# EAGLE schematic MDCBoard (EAGLE 9.6.2)

## Sheet 1 of 12: VDD
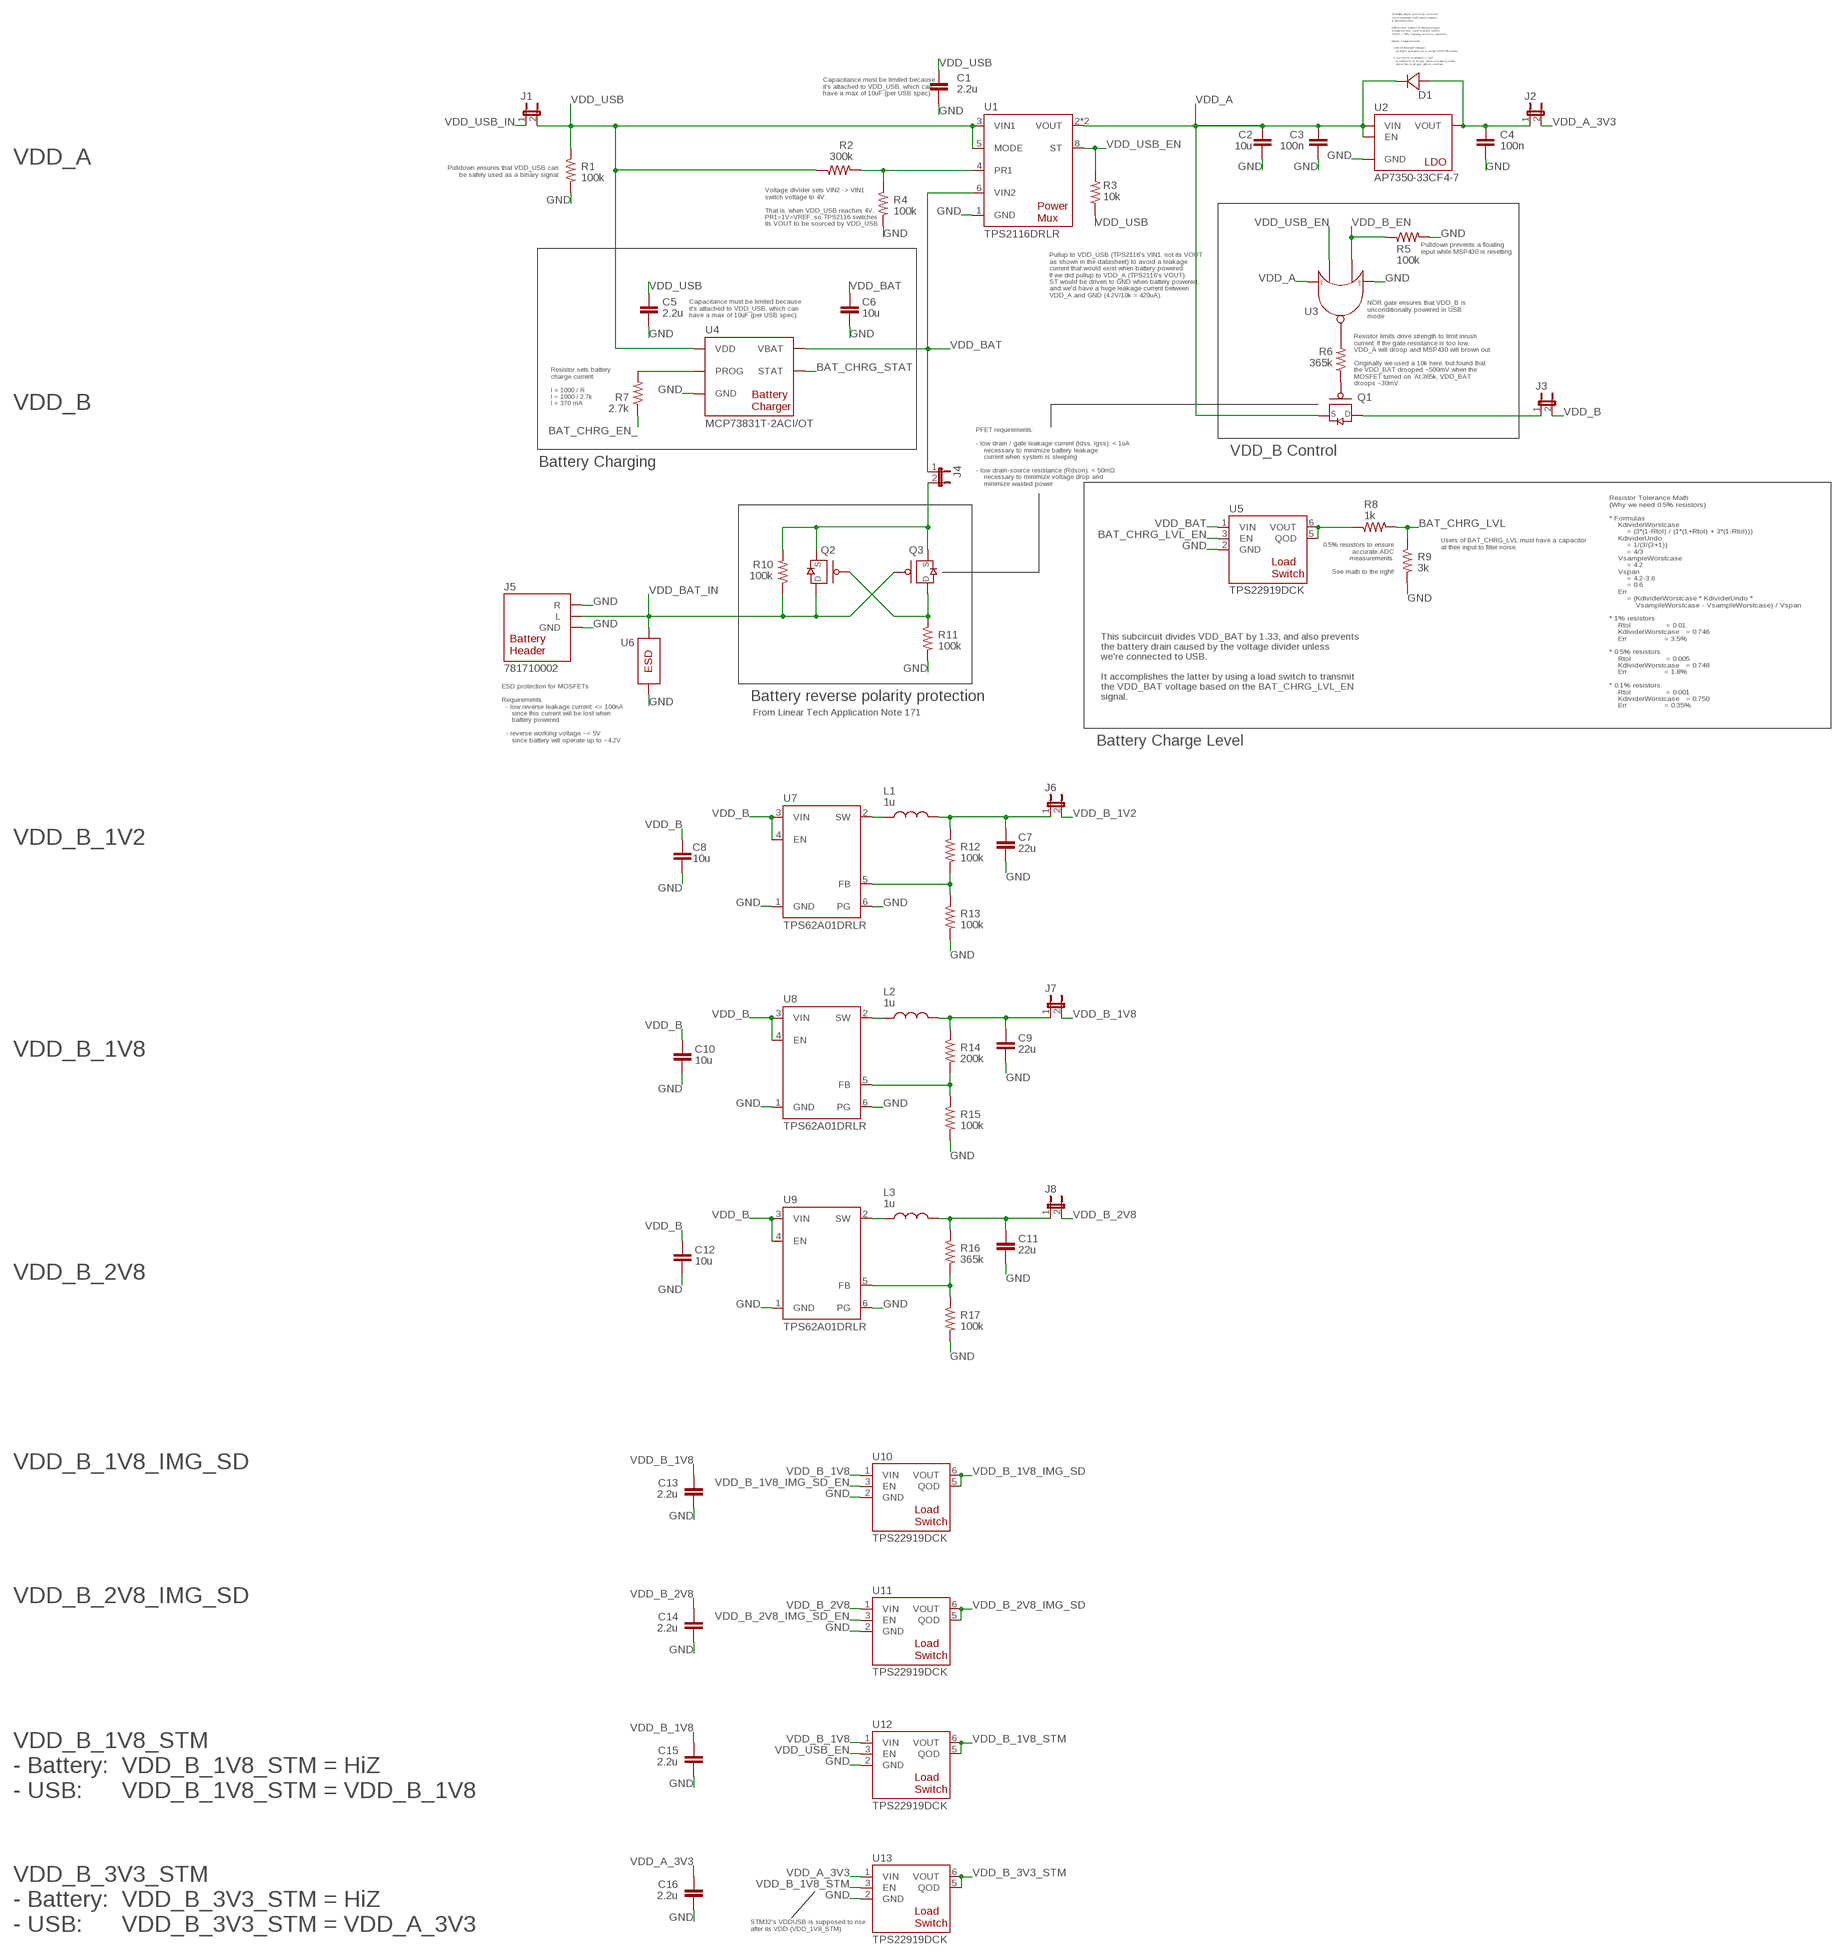
[diagram p0: schematic, sheet 1]

### Parts
C1  2.2u  CAPACITOR0402  [0402]
C2  10u  CAPACITOR0805  [0805]
C3  100n  CAPACITOR0402  [0402]
C4  100n  CAPACITOR0402  [0402]
C5  2.2u  CAPACITOR0402  [0402]
C6  10u  CAPACITOR0805  [0805]
C7  22u  CAPACITOR0805  [0805]
C8  10u  CAPACITOR0805  [0805]
C9  22u  CAPACITOR0805  [0805]
C10  10u  CAPACITOR0805  [0805]
C11  22u  CAPACITOR0805  [0805]
C12  10u  CAPACITOR0805  [0805]
C13  2.2u  CAPACITOR0402  [0402]
C14  2.2u  CAPACITOR0402  [0402]
C15  2.2u  CAPACITOR0402  [0402]
C16  2.2u  CAPACITOR0402  [0402]
D1  ROHM-RB168MM-40  [ROHM-SOD-123FL]
J1  JUMPER-SOLDER-CLOSED  [JUMPER-SOLDER-CLOSED]
J2  JUMPER-SOLDER-CLOSED  [JUMPER-SOLDER-CLOSED]
J3  JUMPER-SOLDER-CLOSED  [JUMPER-SOLDER-CLOSED]
J4  JUMPER-SOLDER-CLOSED  [JUMPER-SOLDER-CLOSED]
J5  BATTERY-HEADER-MOLEX-781710002  [MOLEX-781710002]
J6  JUMPER-SOLDER-CLOSED  [JUMPER-SOLDER-CLOSED]
J7  JUMPER-SOLDER-CLOSED  [JUMPER-SOLDER-CLOSED]
J8  JUMPER-SOLDER-CLOSED  [JUMPER-SOLDER-CLOSED]
L1  1u  INDUCTOR0806  [0806]
L2  1u  INDUCTOR0806  [0806]
L3  1u  INDUCTOR0806  [0806]
Q1  PMOS-NEXPERIA-SOT1220  [NEXPERIA-SOT1220]
Q2  PMOS-NEXPERIA-SOT1220  [NEXPERIA-SOT1220]
Q3  PMOS-NEXPERIA-SOT1220  [NEXPERIA-SOT1220]
R1  100k  RESISTOR0402  [0402]
R2  300k  RESISTOR0402  [0402]
R3  10k  RESISTOR0402  [0402]
R4  100k  RESISTOR0402  [0402]
R5  100k  RESISTOR0402  [0402]
R6  365k  RESISTOR0402  [0402]
R7  2.7k  RESISTOR0402  [0402]
R8  1k  RESISTOR0402  [0402]
R9  3k  RESISTOR0402  [0402]
R10  100k  RESISTOR0402  [0402]
R11  100k  RESISTOR0402  [0402]
R12  100k  RESISTOR0402  [0402]
R13  100k  RESISTOR0402  [0402]
R14  200k  RESISTOR0402  [0402]
R15  100k  RESISTOR0402  [0402]
R16  365k  RESISTOR0402  [0402]
R17  100k  RESISTOR0402  [0402]
U1  TI-TPS2116  [TI-TPS2116DRLR]
U2  DIODESINC-AP7350  [DIODESINC-AP7350]
U3  NEXPERIA-74LVC1G98-NOR  [NEXPERIA-SOT363]
U4  MICROCHIP-MCP7383X  [MICROCHIP-MIC550X-SOT23-5]
U5  TI-TPS22919DCK  [TI-TPS22919DCK]
U6  EATON-STN101  [EATON-STN101]
U7  TI-TPS62A01  [TI-TPS62A01DRLR]
U8  TI-TPS62A01  [TI-TPS62A01DRLR]
U9  TI-TPS62A01  [TI-TPS62A01DRLR]
U10  TI-TPS22919DCK  [TI-TPS22919DCK]
U11  TI-TPS22919DCK  [TI-TPS22919DCK]
U12  TI-TPS22919DCK  [TI-TPS22919DCK]
U13  TI-TPS22919DCK  [TI-TPS22919DCK]

### Nets
BAT_CHRG_EN_: R7.1 ; also sheet 10
BAT_CHRG_LVL: R8.2 R9.1 ; also sheet 2
BAT_CHRG_LVL_EN: U5.3(EN) ; also sheet 2
BAT_CHRG_STAT: U4.1(STAT) ; also sheet 10
GND: C1.2 C2.2 C3.2 C4.2 C5.2 C6.2 C7.2 C8.2 C9.2 C10.2 C11.2 C12.2 C13.2 C14.2 C15.2 C16.2 J5.2(R) J5.3(GND) J5.4(GND) R1.2 R4.2 R5.2 R9.2 R11.2 R13.2 R15.2 R17.2 U1.1(GND) U2.2(GND) U3.2(GND) U4.2(GND) U5.2(GND) U6.2 U7.1(GND) U7.6(PG) U8.1(GND) U8.6(PG) U9.1(GND) U9.6(PG) U10.2(GND) U11.2(GND) U12.2(GND) U13.2(GND) ; also sheet 2,3,4,5,6,7,8,9,10,11,12
N$1: J4.2 Q2.4(S) Q2.8(S) Q3.4(S) Q3.8(S) R10.2
N$3: C4.1 D1.A J2.1 U2.3(VOUT)
N$11: Q1.3(G) R6.1
N$12: R6.2 U3.4(OUT)
N$13: C11.1 J8.1 L3.2 R16.1
N$15: L2.1 U8.2(SW)
N$17: R8.1 U5.5(QOD) U5.6(VOUT)
N$18: R14.2 R15.1 U8.5(FB)
N$19: C9.1 J7.1 L2.2 R14.1
N$21: R7.2 U4.5(PROG)
N$22: L3.1 U9.2(SW)
N$24: L1.1 U7.2(SW)
N$32: Q2.3(G) Q3.1(D) Q3.2(D) Q3.5(D) Q3.6(D) Q3.7(D) R11.1
N$33: R16.2 R17.1 U9.5(FB)
N$34: R12.2 R13.1 U7.5(FB)
N$38: C7.1 J6.1 L1.2 R12.1
N$42: R2.2 R4.1 U1.4(PR1)
N$43: J3.1 Q1.1(D) Q1.2(D) Q1.5(D) Q1.6(D) Q1.7(D)
VDD_A: C2.1 C3.1 D1.C Q1.4(S) Q1.8(S) U1.2(VOUT) U1.7(VOUT) U2.1(EN) U2.4(VIN) U3.3(VDD) U3.5(VDD)
VDD_A_3V3: C16.1 J2.2 U13.1(VIN) ; also sheet 2,3,5
VDD_B: C8.1 C10.1 C12.1 J3.2 U7.3(VIN) U7.4(EN) U8.3(VIN) U8.4(EN) U9.3(VIN) U9.4(EN)
VDD_B_1V2: J6.2 ; also sheet 6
VDD_B_1V8: C13.1 C15.1 J7.2 U10.1(VIN) U12.1(VIN) ; also sheet 2,6,8
VDD_B_1V8_IMG_SD: U10.5(QOD) U10.6(VOUT) ; also sheet 7,9
VDD_B_1V8_IMG_SD_EN: U10.3(EN) ; also sheet 2
VDD_B_1V8_STM: U12.5(QOD) U12.6(VOUT) U13.3(EN) ; also sheet 10
VDD_B_2V8: C14.1 J8.2 U11.1(VIN) ; also sheet 6
VDD_B_2V8_IMG_SD: U11.5(QOD) U11.6(VOUT) ; also sheet 7,9
VDD_B_2V8_IMG_SD_EN: U11.3(EN) ; also sheet 2
VDD_B_3V3_STM: U13.5(QOD) U13.6(VOUT) ; also sheet 2,10
VDD_B_EN: R5.1 U3.6(IN2) ; also sheet 2
VDD_BAT: C6.1 J4.1 U1.6(VIN2) U4.3(VBAT) U5.1(VIN)
VDD_BAT_IN: J5.1(L) Q2.1(D) Q2.2(D) Q2.5(D) Q2.6(D) Q2.7(D) Q3.3(G) R10.1 U6.1
VDD_USB: C1.1 C5.1 J1.2 R1.1 R2.1 R3.1 U1.3(VIN1) U1.5(MODE) U4.4(VDD)
VDD_USB_EN: R3.2 U1.8(ST) U3.1(IN1) U12.3(EN)
VDD_USB_IN: J1.1 ; also sheet 10,11

### Notes on the sheet
- Schottky diode prevents reverse
  current through LDO when battery
  is disconnected.
  
  (When the battery is disconnected,
  it could be the case that the LDO's
  VOUT > VIN, causing reverse current.)
  
  Diode requirements:
  
  - Low Vf (forward voltage)
      so that it activates on a small VOUT-VIN delta
  
  - Ir (reverse leakage) < 1µA
      to minimize leakage when in battery-mode,
      since this leakage will be constant
- Capacitance must be limited because
  it's attached to VDD_USB, which can
  have a max of 10uF (per USB spec).
- VDD_A
- Pulldown ensures that VDD_USB can
  be safely used as a binary signal
- Voltage divider sets VIN2 -> VIN1
  switch voltage to 4V.
  
  That is, when VDD_USB reaches 4V,
  PR1=1V=VREF, so TPS2116 switches
  its VOUT to be sourced by VDD_USB.
- Pulldown prevents a floating
  input while MSP430 is resetting
- Pullup to VDD_USB (TPS2116's VIN1, not its VOUT
  as shown in the datasheet) to avoid a leakage
  current that would exist when battery powered.
  If we did pullup to VDD_A (TPS2116's VOUT),
  ST would be driven to GND when battery powered,
  and we'd have a huge leakage current between
  VDD_A and GND (4.2V/10k = 420uA).
- Capacitance must be limited because
  it's attached to VDD_USB, which can
  have a max of 10uF (per USB spec).
- NOR gate ensures that VDD_B is
  unconditionally powered in USB
  mode
- Resistor limits drive strength to limit inrush
  current. If the gate resistance is too low,
  VDD_A will droop and MSP430 will brown out.
  
  Originally we used a 10k here, but found that
  the VDD_BAT drooped ~500mV when the
  MOSFET turned on. At 365k, VDD_BAT
  droops ~30mV.
- Resistor sets battery
  charge current:
  
  I = 1000 / R
  I = 1000 / 2.7k
  I = 370 mA
- VDD_B
- PFET requirements:
  
  - low drain / gate leakage current (Idss, Igss): < 1uA
      necessary to minimize battery leakage
      current when system is sleeping
  
  - low drain-source resistance (Rdson): < 50mΩ
      necessary to minimize voltage drop and
      minimize wasted power
- VDD_B Control
- Battery Charging
- Resistor Tolerance Math
  (Why we need 0.5% resistors)
  
  * Formulas
      KdividerWorstcase
          = (3*(1-Rtol) / (1*(1+Rtol) + 3*(1-Rtol)))
      KdividerUndo
          = 1/(3/(3+1))
          = 4/3
      VsampleWorstcase
          = 4.2
      Vspan
          = 4.2-3.6
          = 0.6
      Err
          = (KdividerWorstcase * KdividerUndo *
              VsampleWorstcase - VsampleWorstcase) / Vspan
  
  * 1% resistors:
      Rtol                = 0.01
      KdividerWorstcase   = 0.746
      Err                 = 3.5%
  
  * 0.5% resistors:
      Rtol                = 0.005
      KdividerWorstcase   = 0.748
      Err                 = 1.8%
  
  * 0.1% resistors:
      Rtol                = 0.001
      KdividerWorstcase   = 0.750
      Err                 = 0.35%
- Users of BAT_CHRG_LVL must have a capacitor
  at their input to filter noise.
- 0.5% resistors to ensure
  accurate ADC
  measurements.
  
  See math to the right!
- This subcircuit divides VDD_BAT by 1.33, and also prevents
  the battery drain caused by the voltage divider unless
  we're connected to USB.
  
  It accomplishes the latter by using a load switch to transmit
  the VDD_BAT voltage based on the BAT_CHRG_LVL_EN
  signal.
- ESD protection for MOSFETs
  
  Requirements:
    - low reverse leakage current: <= 100nA
       since this current will be lost when
       battery powered
  
    - reverse working voltage ~= 5V
       since battery will operate up to ~4.2V
- Battery reverse polarity protection
- From Linear Tech Application Note 171
- Battery Charge Level
- VDD_B_1V2
- VDD_B_1V8
- VDD_B_2V8
- VDD_B_1V8_IMG_SD
- VDD_B_2V8_IMG_SD
- VDD_B_1V8_STM
  - Battery:  VDD_B_1V8_STM = HiZ
  - USB:      VDD_B_1V8_STM = VDD_B_1V8
- VDD_B_3V3_STM
  - Battery:  VDD_B_3V3_STM = HiZ
  - USB:      VDD_B_3V3_STM = VDD_A_3V3
- STM32's VDDUSB is supposed to rise
  after its VDD (VDD_1V8_STM)

## Sheet 2 of 12: MSP
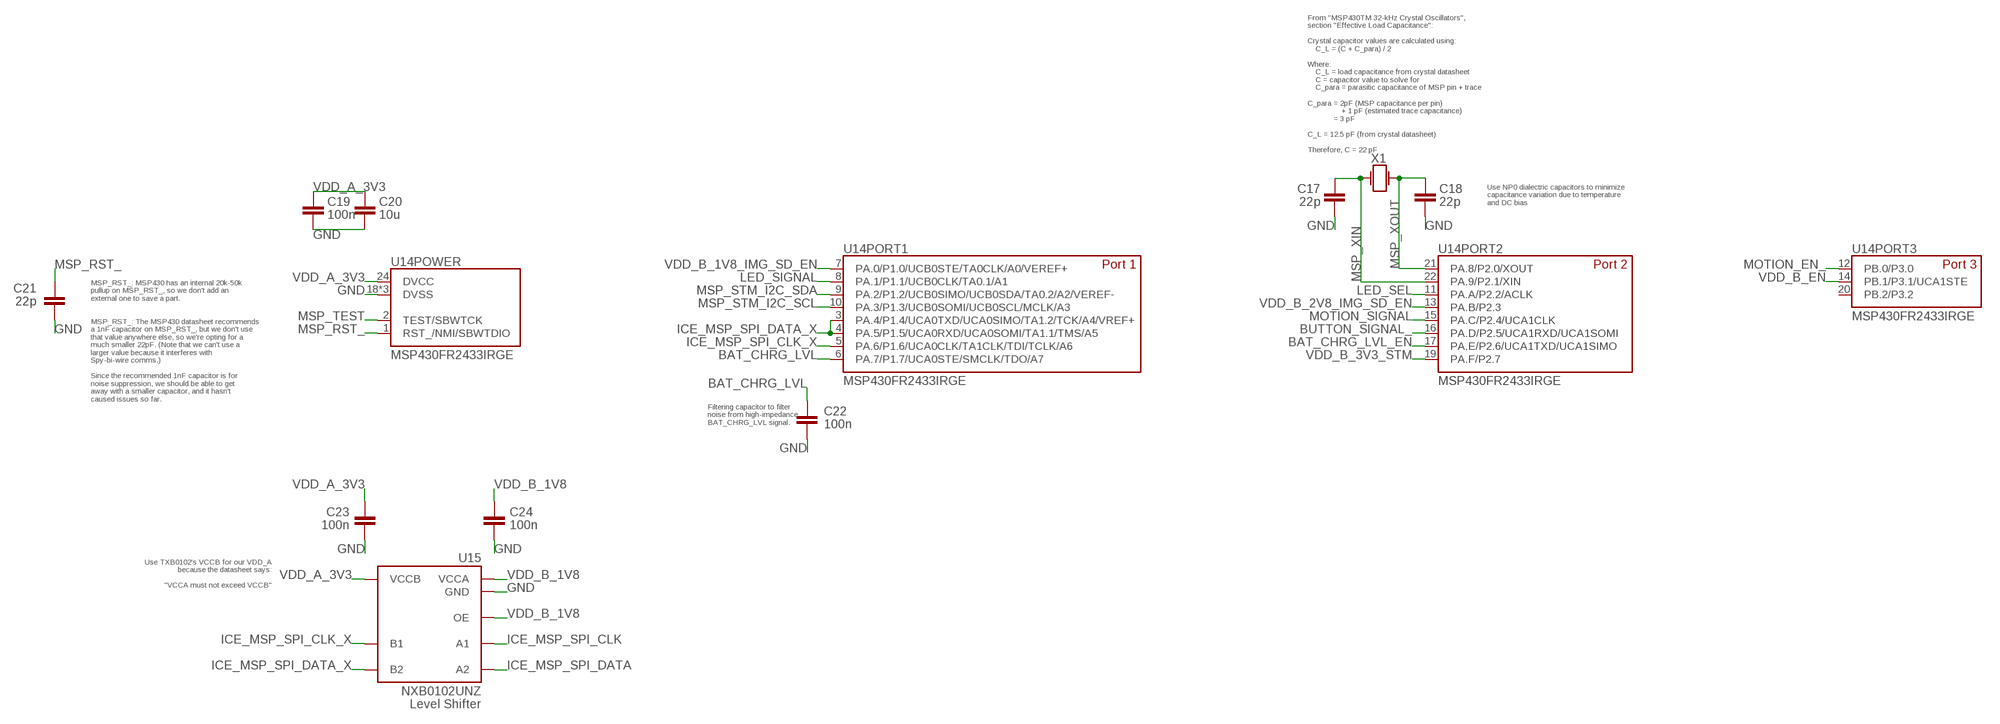
[diagram p1: schematic, sheet 2]

### Parts
C17  22p  CAPACITOR0402  [0402]
C18  22p  CAPACITOR0402  [0402]
C19  100n  CAPACITOR0402  [0402]
C20  10u  CAPACITOR0805  [0805]
C21  22p  CAPACITOR0402  [0402]
C22  100n  CAPACITOR0402  [0402]
C23  100n  CAPACITOR0402  [0402]
C24  100n  CAPACITOR0402  [0402]
U14  TI-MSP430FR2433IRGE  [TI-MSP430FR2433IRGE]
U15  NEXPERIA-NXB0102  [NEXPERIA-NXB0102UN]
X1  EPSON-FC-135  [EPSON-FC-135]

### Nets
BAT_CHRG_LVL: C22.1 U14.6(PORT1:PA.7/P1.7/UCA0STE/SMCLK/TDO/A7) ; also sheet 1
BAT_CHRG_LVL_EN: U14.17(PORT2:PA.E/P2.6/UCA1TXD/UCA1SIMO) ; also sheet 1
BUTTON_SIGNAL_: U14.16(PORT2:PA.D/P2.5/UCA1RXD/UCA1SOMI) ; also sheet 4
GND: C17.2 C18.2 C19.2 C20.2 C21.2 C22.2 C23.2 C24.2 U14.18(POWER:DVSS) U14.23(POWER:DVSS) U14.25(POWER:DVSS) U15.B1(GND) ; also sheet 1,3,4,5,6,7,8,9,10,11,12
ICE_MSP_SPI_CLK: U15.D2(A1) ; also sheet 6
ICE_MSP_SPI_CLK_X: U14.5(PORT1:PA.6/P1.6/UCA0CLK/TA1CLK/TDI/TCLK/A6) U15.A2(B1)
ICE_MSP_SPI_DATA: U15.D1(A2) ; also sheet 6
ICE_MSP_SPI_DATA_X: U14.3(PORT1:PA.4/P1.4/UCA0TXD/UCA0SIMO/TA1.2/TCK/A4/VREF+) U14.4(PORT1:PA.5/P1.5/UCA0RXD/UCA0SOMI/TA1.1/TMS/A5) U15.A1(B2)
LED_SEL: U14.11(PORT2:PA.A/P2.2/ACLK) ; also sheet 3
LED_SIGNAL: U14.8(PORT1:PA.1/P1.1/UCB0CLK/TA0.1/A1) ; also sheet 3
MOTION_EN_: U14.12(PORT3:PB.0/P3.0) ; also sheet 5
MOTION_SIGNAL: U14.15(PORT2:PA.C/P2.4/UCA1CLK) ; also sheet 5
MSP_RST_: C21.1 U14.1(POWER:RST_/NMI/SBWTDIO) ; also sheet 10
MSP_STM_I2C_SCL: U14.10(PORT1:PA.3/P1.3/UCB0SOMI/UCB0SCL/MCLK/A3) ; also sheet 10
MSP_STM_I2C_SDA: U14.9(PORT1:PA.2/P1.2/UCB0SIMO/UCB0SDA/TA0.2/A2/VEREF-) ; also sheet 10
MSP_TEST: U14.2(POWER:TEST/SBWTCK) ; also sheet 10
MSP_XIN: C17.1 U14.22(PORT2:PA.9/P2.1/XIN) X1.2(B)
MSP_XOUT: C18.1 U14.21(PORT2:PA.8/P2.0/XOUT) X1.1(A)
VDD_A_3V3: C19.1 C20.1 C23.1 U14.24(POWER:DVCC) U15.B2(VCCB) ; also sheet 1,3,5
VDD_B_1V8: C24.1 U15.C1(VCCA) U15.C2(OE) ; also sheet 1,6,8
VDD_B_1V8_IMG_SD_EN: U14.7(PORT1:PA.0/P1.0/UCB0STE/TA0CLK/A0/VEREF+) ; also sheet 1
VDD_B_2V8_IMG_SD_EN: U14.13(PORT2:PA.B/P2.3) ; also sheet 1
VDD_B_3V3_STM: U14.19(PORT2:PA.F/P2.7) ; also sheet 1,10
VDD_B_EN: U14.14(PORT3:PB.1/P3.1/UCA1STE) ; also sheet 1
Unconnected: U14.20(PORT3:PB.2/P3.2)

### Notes on the sheet
- From "MSP430TM 32-kHz Crystal Oscillators",
  section "Effective Load Capacitance":
  
  Crystal capacitor values are calculated using:
      C_L = (C + C_para) / 2
  
  Where:
      C_L = load capacitance from crystal datasheet
      C = capacitor value to solve for
      C_para = parasitic capacitance of MSP pin + trace
  
  C_para = 2pF (MSP capacitance per pin)
                   + 1 pF (estimated trace capacitance)
               = 3 pF
  
  C_L = 12.5 pF (from crystal datasheet)
  
  Therefore, C = 22 pF
- Use NP0 dialectric capacitors to minimize
  capacitance variation due to temperature
  and DC bias
- MSP_RST_: MSP430 has an internal 20k-50k
  pullup on MSP_RST_, so we don't add an
  external one to save a part.
- MSP_RST_: The MSP430 datasheet recommends
  a 1nF capacitor on MSP_RST_, but we don't use
  that value anywhere else, so we're opting for a
  much smaller 22pF. (Note that we can't use a
  larger value because it interferes with
  Spy-bi-wire comms.)
  
  Since the recommended 1nF capacitor is for
  noise suppression, we should be able to get
  away with a smaller capacitor, and it hasn't
  caused issues so far.
- Filtering capacitor to filter
  noise from high-impedance
  BAT_CHRG_LVL signal.
- Use TXB0102's VCCB for our VDD_A
  because the datasheet says:
  
  "VCCA must not exceed VCCB"

## Sheet 3 of 12: LED
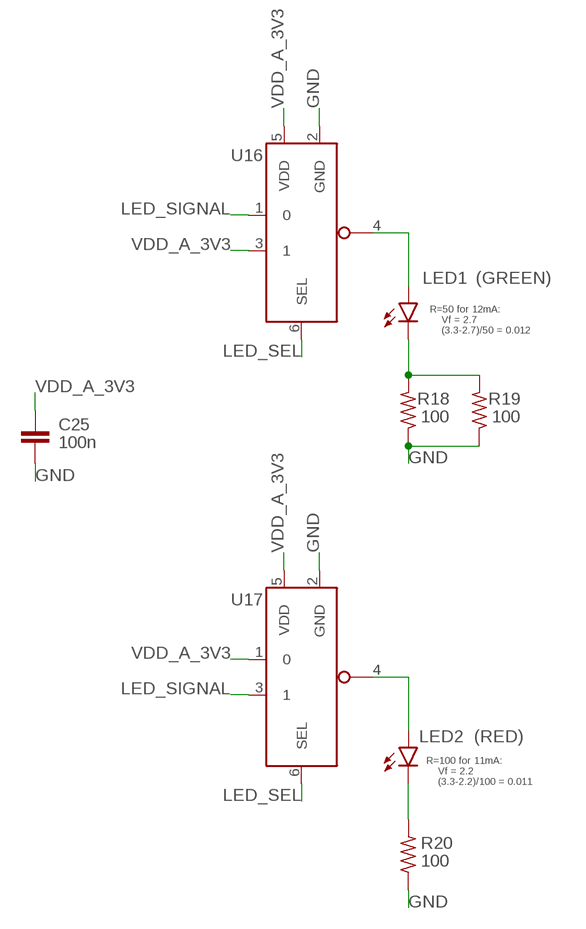
[diagram p2: schematic, sheet 3]

### Parts
C25  100n  CAPACITOR0402  [0402]
LED1  LEDOSRAM-TOPLED-E1608  [OSRAM-TOPLED-E1608]
LED2  LEDOSRAM-TOPLED-E1608  [OSRAM-TOPLED-E1608]
R18  100  RESISTOR0402  [0402]
R19  100  RESISTOR0402  [0402]
R20  100  RESISTOR0402  [0402]
U16  NEXPERIA-74LVC1G98-MUX-INV-OUTPUT  [NEXPERIA-SOT363]
U17  NEXPERIA-74LVC1G98-MUX-INV-OUTPUT  [NEXPERIA-SOT363]

### Nets
GND: C25.2 R18.1 R19.1 R20.1 U16.2(GND) U17.2(GND) ; also sheet 1,2,4,5,6,7,8,9,10,11,12
LED_SEL: U16.6(SEL) U17.6(SEL) ; also sheet 2
LED_SIGNAL: U16.1 U17.3 ; also sheet 2
N$5: LED1.A U16.4(OUT)
N$6: LED2.A U17.4(OUT)
N$16: LED2.C R20.2
N$45: LED1.C R18.2 R19.2
VDD_A_3V3: C25.1 U16.3 U16.5(VDD) U17.1 U17.5(VDD) ; also sheet 1,2,5

### Notes on the sheet
- (GREEN)
- R=50 for 12mA:
      Vf = 2.7
      (3.3-2.7)/50 = 0.012
- (RED)
- R=100 for 11mA:
      Vf = 2.2
      (3.3-2.2)/100 = 0.011

## Sheet 4 of 12: BUTTON
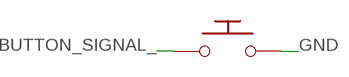
[diagram p3: schematic, sheet 4]

### Parts
SW1  TACTILE-SWITCH  [DEALON-TD-1624UR-180]

### Nets
BUTTON_SIGNAL_: SW1.1 ; also sheet 2
GND: SW1.2 ; also sheet 1,2,3,5,6,7,8,9,10,11,12

## Sheet 5 of 12: MOTION
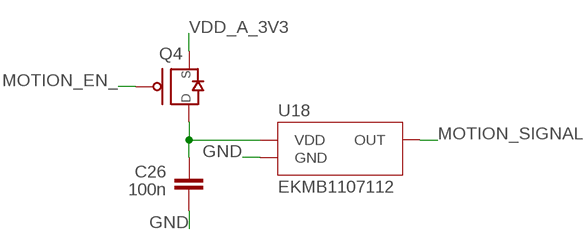
[diagram p4: schematic, sheet 5]

### Parts
C26  100n  CAPACITOR0402  [0402]
Q4  DIODESINC-DMG2305UX  [DIODESINC-DMG2305UX]
U18  PANASONIC-EKMB110711X  [PANASONIC-EKMB110711X]

### Nets
GND: C26.2 U18.3(GND) ; also sheet 1,2,3,4,6,7,8,9,10,11,12
MOTION_EN_: Q4.G ; also sheet 2
MOTION_SIGNAL: U18.2(OUT) ; also sheet 2
N$8: C26.1 Q4.D U18.1(VDD)
VDD_A_3V3: Q4.S ; also sheet 1,2,3

## Sheet 6 of 12: ICE
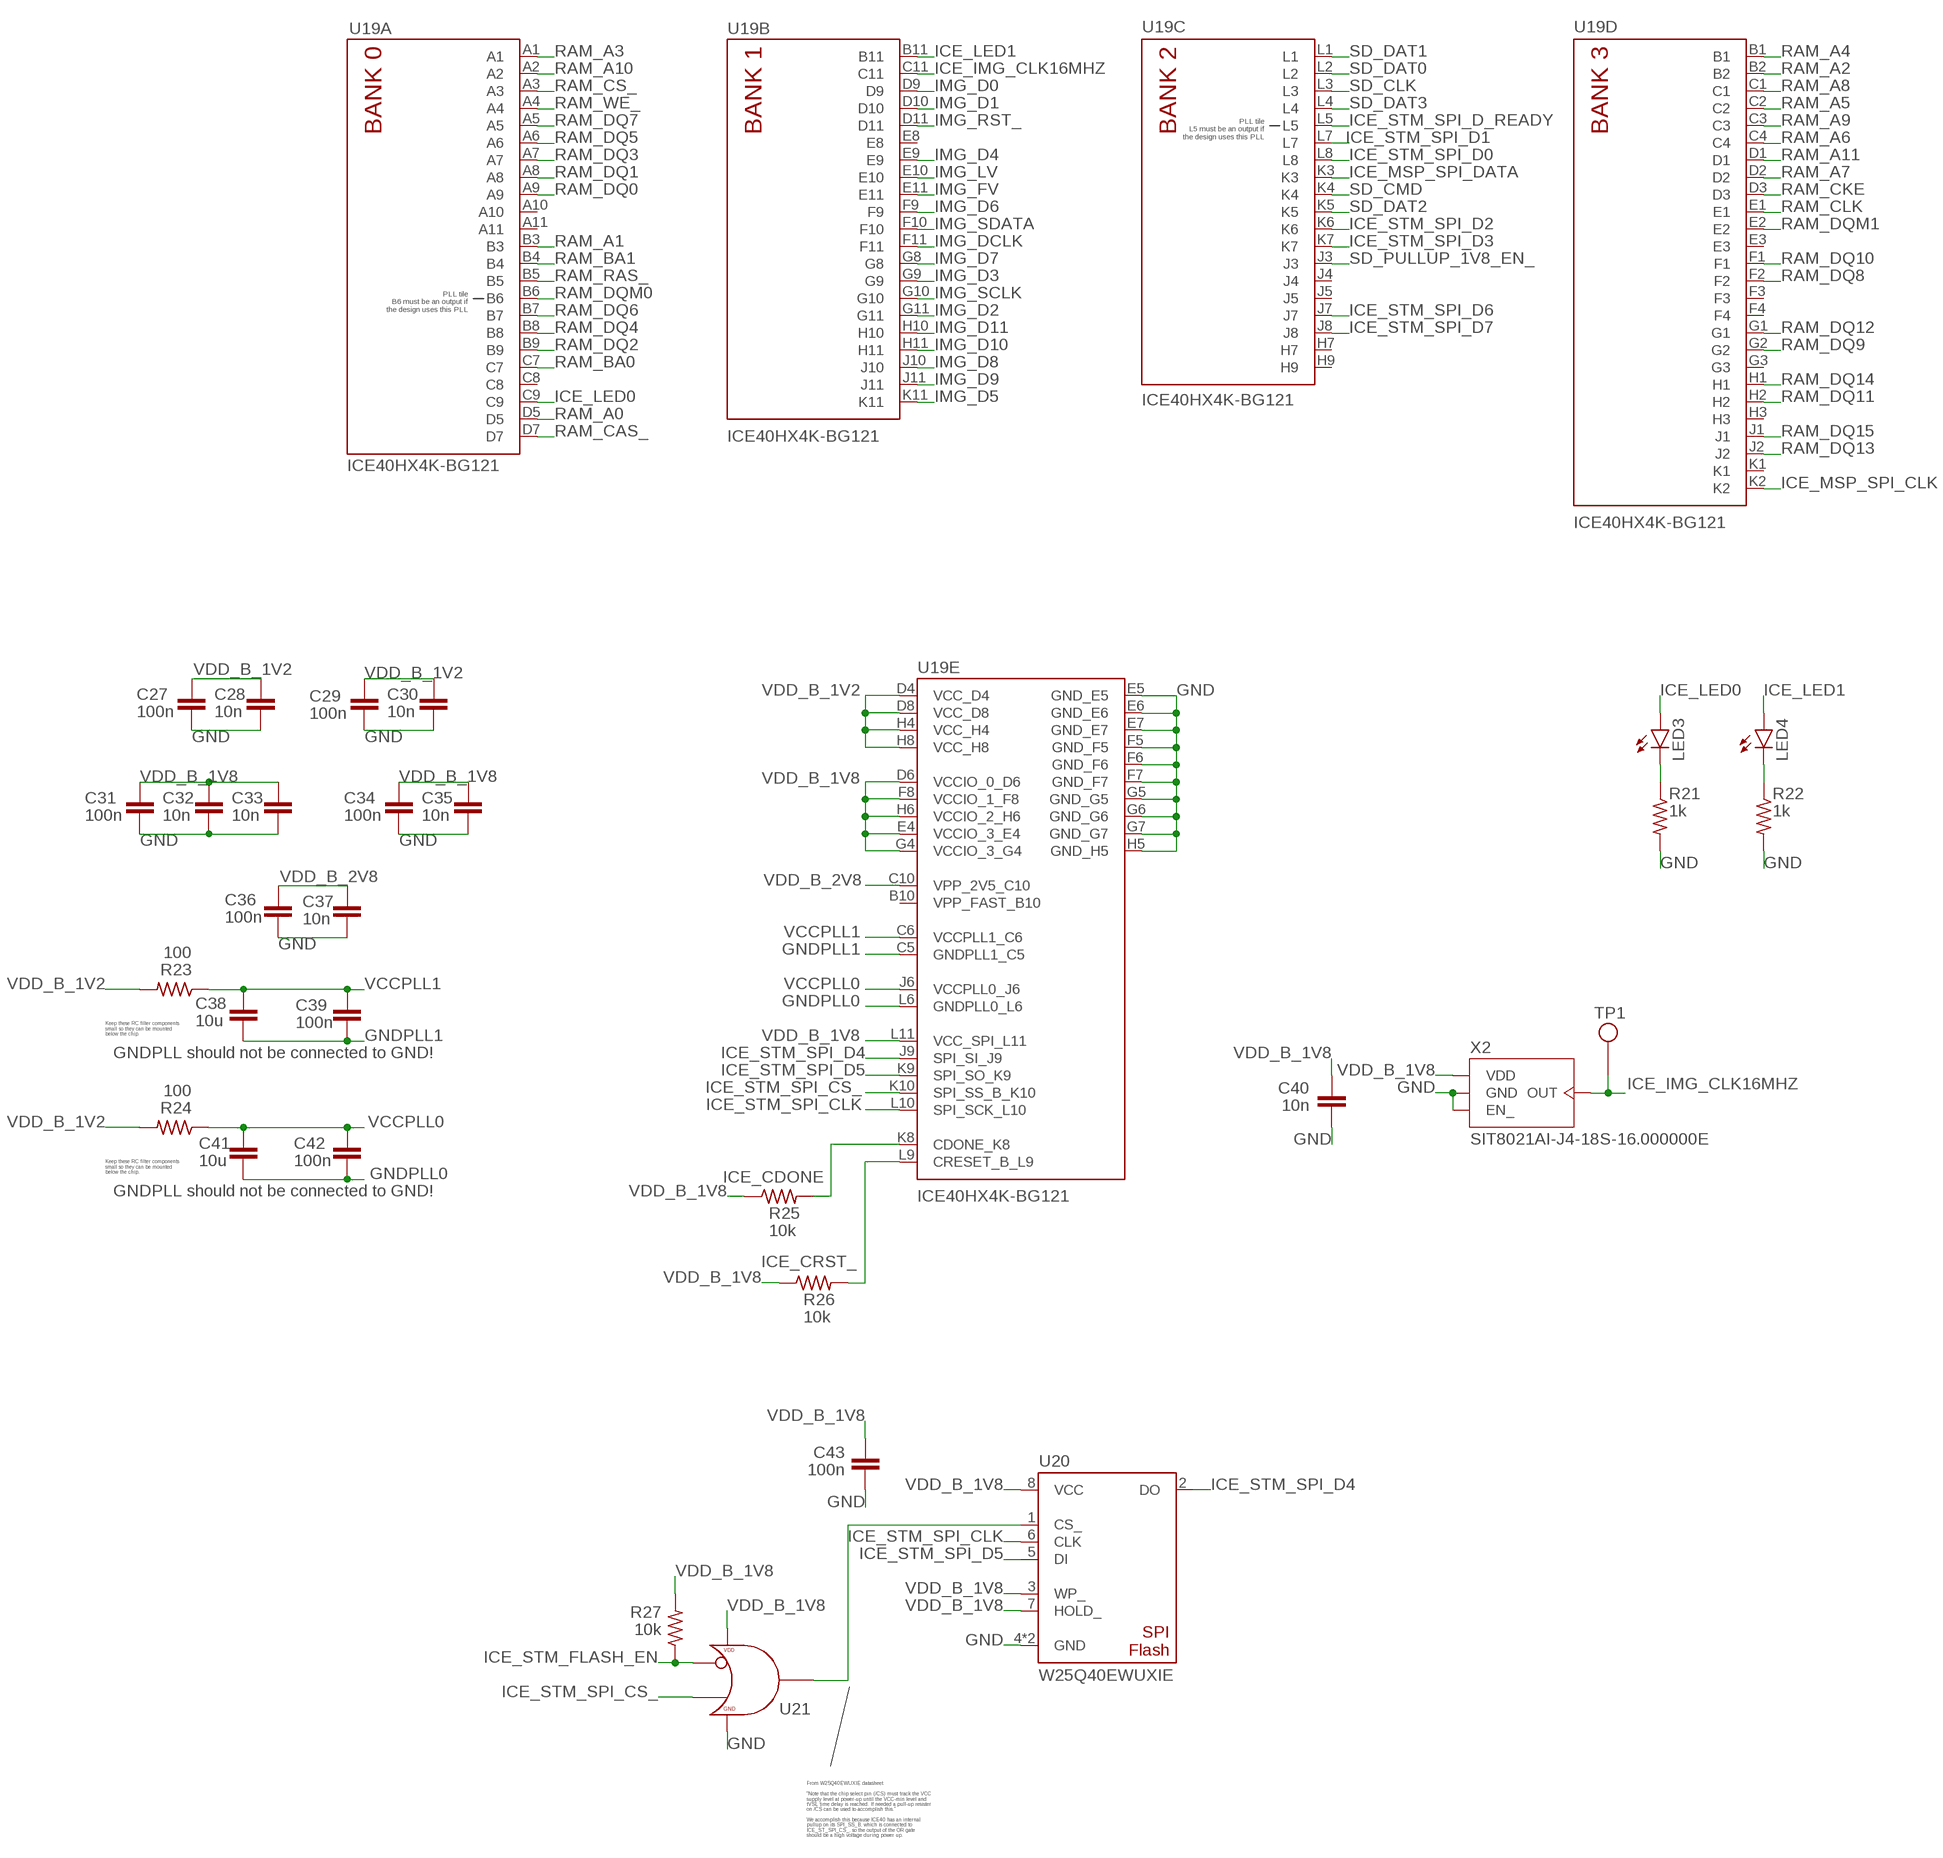
[diagram p5: schematic, sheet 6]

### Parts
C27  100n  CAPACITOR0402  [0402]
C28  10n  CAPACITOR0402  [0402]
C29  100n  CAPACITOR0402  [0402]
C30  10n  CAPACITOR0402  [0402]
C31  100n  CAPACITOR0402  [0402]
C32  10n  CAPACITOR0402  [0402]
C33  10n  CAPACITOR0402  [0402]
C34  100n  CAPACITOR0402  [0402]
C35  10n  CAPACITOR0402  [0402]
C36  100n  CAPACITOR0402  [0402]
C37  10n  CAPACITOR0402  [0402]
C38  10u  CAPACITOR0805  [0805]
C39  100n  CAPACITOR0402  [0402]
C40  10n  CAPACITOR0402  [0402]
C41  10u  CAPACITOR0805  [0805]
C42  100n  CAPACITOR0402  [0402]
C43  100n  CAPACITOR0402  [0402]
LED3  LEDLED-0603  [LED-0603]
LED4  LEDLED-0603  [LED-0603]
R21  1k  RESISTOR0402  [0402]
R22  1k  RESISTOR0402  [0402]
R23  100  RESISTOR0402  [0402]
R24  100  RESISTOR0402  [0402]
R25  10k  RESISTOR0402  [0402]
R26  10k  RESISTOR0402  [0402]
R27  10k  RESISTOR0402  [0402]
TP1  TEST-POINT  [TEST-POINT]
U19  LATTICE-ICE40HX4K-BG121  [LATTICE-ICE40HX4K-BG121]
U20  WINBOND-W25Q40EW  [WINBOND-W25Q40EWUXIE]
U21  NEXPERIA-74LVC1G98-OR-INV-INPUT  [NEXPERIA-SOT363]
X2  SITIME-SIT8021  [SITIME-SIT8021]

### Nets
GND: C27.2 C28.2 C29.2 C30.2 C31.2 C32.2 C33.2 C34.2 C35.2 C36.2 C37.2 C40.2 C43.2 R21.2 R22.2 U19.E5(E:GND_E5) U19.E6(E:GND_E6) U19.E7(E:GND_E7) U19.F5(E:GND_F5) U19.F6(E:GND_F6) U19.F7(E:GND_F7) U19.G5(E:GND_G5) U19.G6(E:GND_G6) U19.G7(E:GND_G7) U19.H5(E:GND_H5) U20.4(GND) U20.9(GND) U21.2(GND) U21.3(GND) X2.1(EN_) X2.4(GND) ; also sheet 1,2,3,4,5,7,8,9,10,11,12
GNDPLL0: C41.2 C42.2 U19.L6(E:GNDPLL0_L6)
GNDPLL1: C38.2 C39.2 U19.C5(E:GNDPLL1_C5)
ICE_CDONE: R25.2 U19.K8(E:CDONE_K8) ; also sheet 10
ICE_CRST_: R26.2 U19.L9(E:CRESET_B_L9) ; also sheet 10
ICE_IMG_CLK16MHZ: TP1.X U19.C11(B:C11) X2.2(OUT) ; also sheet 7
ICE_LED0: LED3.A U19.C9(A:C9)
ICE_LED1: LED4.A U19.B11(B:B11)
ICE_MSP_SPI_CLK: U19.K2(D:K2) ; also sheet 2
ICE_MSP_SPI_DATA: U19.K3(C:K3) ; also sheet 2
ICE_STM_FLASH_EN: R27.1 U21.1(IN1) ; also sheet 10
ICE_STM_SPI_CLK: U19.L10(E:SPI_SCK_L10) U20.6(CLK) ; also sheet 10
ICE_STM_SPI_CS_: U19.K10(E:SPI_SS_B_K10) U21.6(IN2) ; also sheet 10
ICE_STM_SPI_D0: U19.L8(C:L8) ; also sheet 10
ICE_STM_SPI_D1: U19.L7(C:L7) ; also sheet 10
ICE_STM_SPI_D2: U19.K6(C:K6) ; also sheet 10
ICE_STM_SPI_D3: U19.K7(C:K7) ; also sheet 10
ICE_STM_SPI_D4: U19.J9(E:SPI_SI_J9) U20.2(DO) ; also sheet 10
ICE_STM_SPI_D5: U19.K9(E:SPI_SO_K9) U20.5(DI) ; also sheet 10
ICE_STM_SPI_D6: U19.J7(C:J7) ; also sheet 10
ICE_STM_SPI_D7: U19.J8(C:J8) ; also sheet 10
ICE_STM_SPI_D_READY: U19.L5(C:L5) ; also sheet 10
IMG_D0: U19.D9(B:D9) ; also sheet 7
IMG_D1: U19.D10(B:D10) ; also sheet 7
IMG_D2: U19.G11(B:G11) ; also sheet 7
IMG_D3: U19.G9(B:G9) ; also sheet 7
IMG_D4: U19.E9(B:E9) ; also sheet 7
IMG_D5: U19.K11(B:K11) ; also sheet 7
IMG_D6: U19.F9(B:F9) ; also sheet 7
IMG_D7: U19.G8(B:G8) ; also sheet 7
IMG_D8: U19.J10(B:J10) ; also sheet 7
IMG_D9: U19.J11(B:J11) ; also sheet 7
IMG_D10: U19.H11(B:H11) ; also sheet 7
IMG_D11: U19.H10(B:H10) ; also sheet 7
IMG_DCLK: U19.F11(B:F11) ; also sheet 7
IMG_FV: U19.E11(B:E11) ; also sheet 7
IMG_LV: U19.E10(B:E10) ; also sheet 7
IMG_RST_: U19.D11(B:D11) ; also sheet 7
IMG_SCLK: U19.G10(B:G10) ; also sheet 7
IMG_SDATA: U19.F10(B:F10) ; also sheet 7
N$23: LED3.C R21.1
N$28: LED4.C R22.1
N$40: U20.1(CS_) U21.4(OUT)
RAM_A0: U19.D5(A:D5) ; also sheet 8
RAM_A1: U19.B3(A:B3) ; also sheet 8
RAM_A2: U19.B2(D:B2) ; also sheet 8
RAM_A3: U19.A1(A:A1) ; also sheet 8
RAM_A4: U19.B1(D:B1) ; also sheet 8
RAM_A5: U19.C2(D:C2) ; also sheet 8
RAM_A6: U19.C4(D:C4) ; also sheet 8
RAM_A7: U19.D2(D:D2) ; also sheet 8
RAM_A8: U19.C1(D:C1) ; also sheet 8
RAM_A9: U19.C3(D:C3) ; also sheet 8
RAM_A10: U19.A2(A:A2) ; also sheet 8
RAM_A11: U19.D1(D:D1) ; also sheet 8
RAM_BA0: U19.C7(A:C7) ; also sheet 8
RAM_BA1: U19.B4(A:B4) ; also sheet 8
RAM_CAS_: U19.D7(A:D7) ; also sheet 8
RAM_CKE: U19.D3(D:D3) ; also sheet 8
RAM_CLK: U19.E1(D:E1) ; also sheet 8
RAM_CS_: U19.A3(A:A3) ; also sheet 8
RAM_DQ0: U19.A9(A:A9) ; also sheet 8
RAM_DQ1: U19.A8(A:A8) ; also sheet 8
RAM_DQ2: U19.B9(A:B9) ; also sheet 8
RAM_DQ3: U19.A7(A:A7) ; also sheet 8
RAM_DQ4: U19.B8(A:B8) ; also sheet 8
RAM_DQ5: U19.A6(A:A6) ; also sheet 8
RAM_DQ6: U19.B7(A:B7) ; also sheet 8
RAM_DQ7: U19.A5(A:A5) ; also sheet 8
RAM_DQ8: U19.F2(D:F2) ; also sheet 8
RAM_DQ9: U19.G2(D:G2) ; also sheet 8
RAM_DQ10: U19.F1(D:F1) ; also sheet 8
RAM_DQ11: U19.H2(D:H2) ; also sheet 8
RAM_DQ12: U19.G1(D:G1) ; also sheet 8
RAM_DQ13: U19.J2(D:J2) ; also sheet 8
RAM_DQ14: U19.H1(D:H1) ; also sheet 8
RAM_DQ15: U19.J1(D:J1) ; also sheet 8
RAM_DQM0: U19.B6(A:B6) ; also sheet 8
RAM_DQM1: U19.E2(D:E2) ; also sheet 8
RAM_RAS_: U19.B5(A:B5) ; also sheet 8
RAM_WE_: U19.A4(A:A4) ; also sheet 8
SD_CLK: U19.L3(C:L3) ; also sheet 9
SD_CMD: U19.K4(C:K4) ; also sheet 9
SD_DAT0: U19.L2(C:L2) ; also sheet 9
SD_DAT1: U19.L1(C:L1) ; also sheet 9
SD_DAT2: U19.K5(C:K5) ; also sheet 9
SD_DAT3: U19.L4(C:L4) ; also sheet 9
SD_PULLUP_1V8_EN_: U19.J3(C:J3) ; also sheet 9
VCCPLL0: C41.1 C42.1 R24.1 U19.J6(E:VCCPLL0_J6)
VCCPLL1: C38.1 C39.1 R23.1 U19.C6(E:VCCPLL1_C6)
VDD_B_1V2: C27.1 C28.1 C29.1 C30.1 R23.2 R24.2 U19.D4(E:VCC_D4) U19.D8(E:VCC_D8) U19.H4(E:VCC_H4) U19.H8(E:VCC_H8) ; also sheet 1
VDD_B_1V8: C31.1 C32.1 C33.1 C34.1 C35.1 C40.1 C43.1 R25.1 R26.1 R27.2 U19.D6(E:VCCIO_0_D6) U19.E4(E:VCCIO_3_E4) U19.F8(E:VCCIO_1_F8) U19.G4(E:VCCIO_3_G4) U19.H6(E:VCCIO_2_H6) U19.L11(E:VCC_SPI_L11) U20.3(WP_) U20.7(HOLD_) U20.8(VCC) U21.5(VDD) X2.3(VDD) ; also sheet 1,2,8
VDD_B_2V8: C36.1 C37.1 U19.C10(E:VPP_2V5_C10) ; also sheet 1
Unconnected: U19.A10(A:A10) U19.A11(A:A11) U19.B10(E:VPP_FAST_B10) U19.C8(A:C8) U19.E3(D:E3) U19.E8(B:E8) U19.F3(D:F3) U19.F4(D:F4) U19.G3(D:G3) U19.H3(D:H3) U19.H7(C:H7) U19.H9(C:H9) U19.J4(C:J4) U19.J5(C:J5) U19.K1(D:K1)

### Notes on the sheet
- Keep these RC filter components
  small so they can be mounted
  below the chip.
- GNDPLL should not be connected to GND!
- Keep these RC filter components
  small so they can be mounted
  below the chip.
- GNDPLL should not be connected to GND!
- From W25Q40EWUXIE datasheet:
  
  "Note that the chip select pin (/CS) must track the VCC
  supply level at power-up until the VCC-min level and
  tVSL time delay is reached. If needed a pull-up resister
  on /CS can be used to accomplish this."
  
  We accomplish this because ICE40 has an internal
  pullup on its SPI_SS_B, which is connected to
  ICE_ST_SPI_CS_, so the output of the OR gate
  should be a high voltage during power up.

## Sheet 7 of 12: IMG
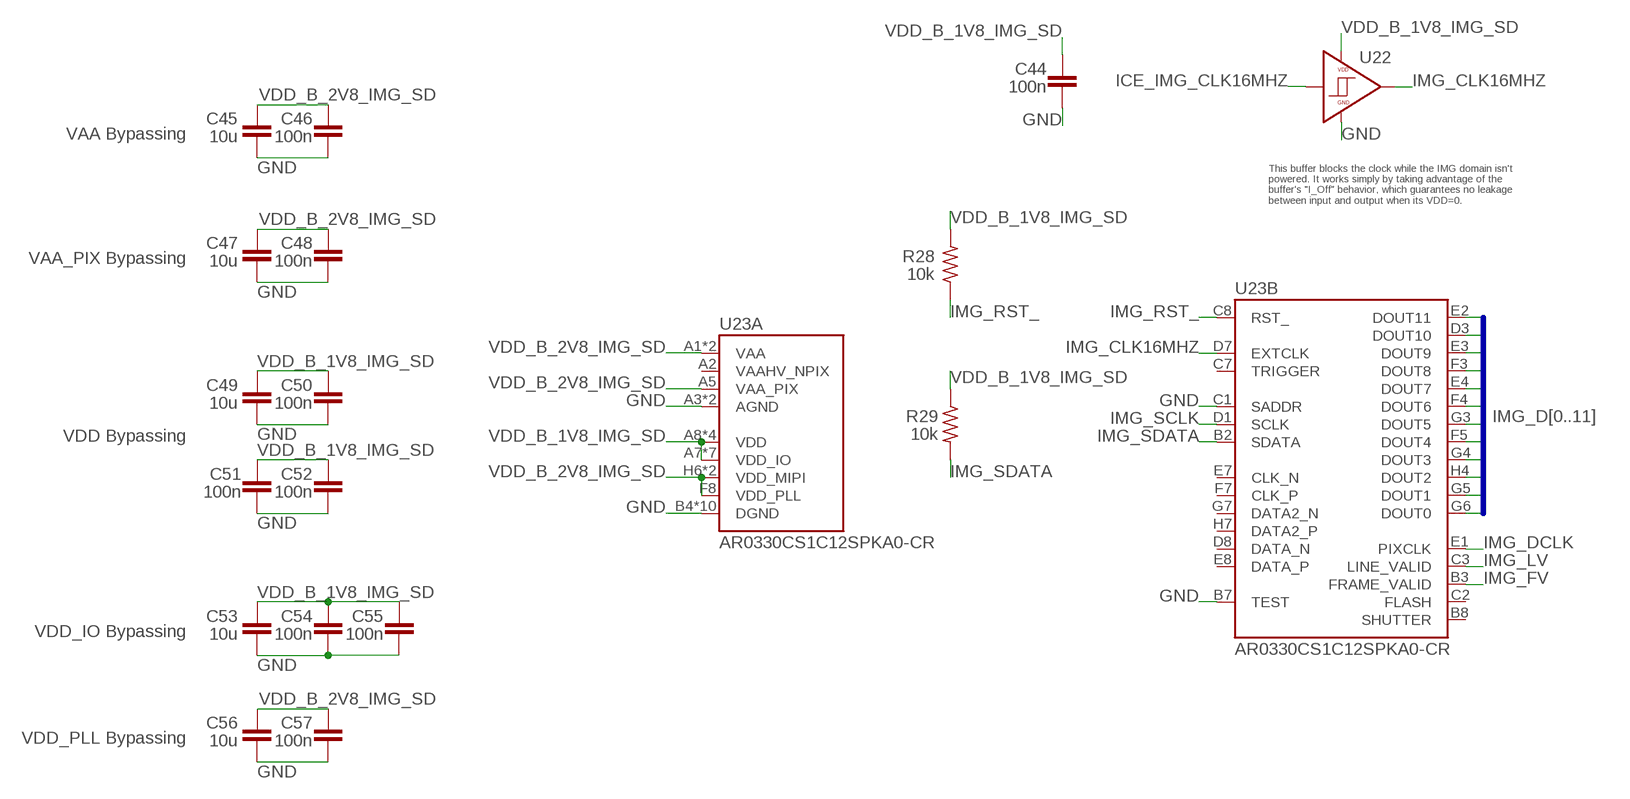
[diagram p6: schematic, sheet 7]

### Parts
C44  100n  CAPACITOR0402  [0402]
C45  10u  CAPACITOR0805  [0805]
C46  100n  CAPACITOR0402  [0402]
C47  10u  CAPACITOR0805  [0805]
C48  100n  CAPACITOR0402  [0402]
C49  10u  CAPACITOR0805  [0805]
C50  100n  CAPACITOR0402  [0402]
C51  100n  CAPACITOR0402  [0402]
C52  100n  CAPACITOR0402  [0402]
C53  10u  CAPACITOR0805  [0805]
C54  100n  CAPACITOR0402  [0402]
C55  100n  CAPACITOR0402  [0402]
C56  10u  CAPACITOR0805  [0805]
C57  100n  CAPACITOR0402  [0402]
R28  10k  RESISTOR0402  [0402]
R29  10k  RESISTOR0402  [0402]
U22  NEXPERIA-74LVC1G98-BUFFER  [NEXPERIA-SOT363]
U23  ON-AR0330CS1C12SPKA0  [ON-AR0330CS1C12SPKA0]

### Nets
GND: C44.2 C45.2 C46.2 C47.2 C48.2 C49.2 C50.2 C51.2 C52.2 C53.2 C54.2 C55.2 C56.2 C57.2 U22.2(GND) U22.3(GND) U23.A3(A:AGND) U23.B4(A:DGND) U23.B5(A:AGND) U23.B6(A:DGND) U23.B7(B:TEST) U23.C1(B:SADDR) U23.C4(A:DGND) U23.C5(A:DGND) U23.C6(A:DGND) U23.D4(A:DGND) U23.E6(A:DGND) U23.G1(A:DGND) U23.H2(A:DGND) U23.H3(A:DGND) ; also sheet 1,2,3,4,5,6,8,9,10,11,12
ICE_IMG_CLK16MHZ: U22.6(IN) ; also sheet 6
IMG_CLK16MHZ: U22.4(OUT) U23.D7(B:EXTCLK)
IMG_D0: U23.G6(B:DOUT0) ; also sheet 6
IMG_D1: U23.G5(B:DOUT1) ; also sheet 6
IMG_D2: U23.H4(B:DOUT2) ; also sheet 6
IMG_D3: U23.G4(B:DOUT3) ; also sheet 6
IMG_D4: U23.F5(B:DOUT4) ; also sheet 6
IMG_D5: U23.G3(B:DOUT5) ; also sheet 6
IMG_D6: U23.F4(B:DOUT6) ; also sheet 6
IMG_D7: U23.E4(B:DOUT7) ; also sheet 6
IMG_D8: U23.F3(B:DOUT8) ; also sheet 6
IMG_D9: U23.E3(B:DOUT9) ; also sheet 6
IMG_D10: U23.D3(B:DOUT10) ; also sheet 6
IMG_D11: U23.E2(B:DOUT11) ; also sheet 6
IMG_DCLK: U23.E1(B:PIXCLK) ; also sheet 6
IMG_FV: U23.B3(B:FRAME_VALID) ; also sheet 6
IMG_LV: U23.C3(B:LINE_VALID) ; also sheet 6
IMG_RST_: R28.1 U23.C8(B:RST_) ; also sheet 6
IMG_SCLK: U23.D1(B:SCLK) ; also sheet 6
IMG_SDATA: R29.2 U23.B2(B:SDATA) ; also sheet 6
VDD_B_1V8_IMG_SD: C44.1 C49.1 C50.1 C51.1 C52.1 C53.1 C54.1 C55.1 R28.2 R29.1 U22.1(VDD) U22.5(VDD) U23.A7(A:VDD_IO) U23.A8(A:VDD) U23.B1(A:VDD) U23.D2(A:VDD_IO) U23.D5(A:VDD_IO) U23.D6(A:VDD_IO) U23.E5(A:VDD_IO) U23.F6(A:VDD_IO) U23.G2(A:VDD) U23.G8(A:VDD) U23.H5(A:VDD_IO) ; also sheet 1,9
VDD_B_2V8_IMG_SD: C45.1 C46.1 C47.1 C48.1 C56.1 C57.1 U23.A1(A:VAA) U23.A5(A:VAA_PIX) U23.A6(A:VAA) U23.F8(A:VDD_PLL) U23.H6(A:VDD_MIPI) U23.H8(A:VDD_MIPI) ; also sheet 1,9
Unconnected: U23.A2(A:VAAHV_NPIX) U23.B8(B:SHUTTER) U23.C2(B:FLASH) U23.C7(B:TRIGGER) U23.D8(B:DATA_N) U23.E7(B:CLK_N) U23.E8(B:DATA_P) U23.F7(B:CLK_P) U23.G7(B:DATA2_N) U23.H7(B:DATA2_P)

### Buses
IMG_D[0..11]

### Notes on the sheet
- VAA Bypassing
- This buffer blocks the clock while the IMG domain isn't
  powered. It works simply by taking advantage of the
  buffer's "I_Off" behavior, which guarantees no leakage
  between input and output when its VDD=0.
- VAA_PIX Bypassing
- VDD Bypassing
- VDD_IO Bypassing
- VDD_PLL Bypassing

## Sheet 8 of 12: RAM
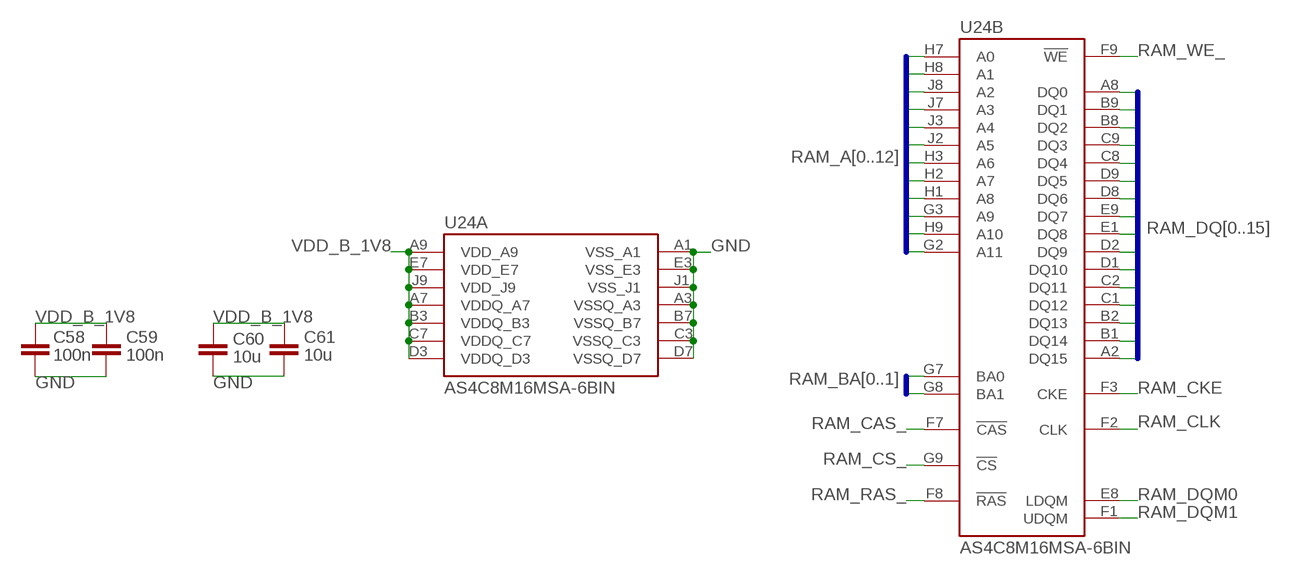
[diagram p7: schematic, sheet 8]

### Parts
C58  100n  CAPACITOR0402  [0402]
C59  100n  CAPACITOR0402  [0402]
C60  10u  CAPACITOR0805  [0805]
C61  10u  CAPACITOR0805  [0805]
U24  ALLIANCE-AS4C8M16MSA-6BIN  [ALLIANCE-AS4C8M16MSA-6BIN]

### Nets
GND: C58.2 C59.2 C60.2 C61.2 U24.A1(A:VSS_A1) U24.A3(A:VSSQ_A3) U24.B7(A:VSSQ_B7) U24.C3(A:VSSQ_C3) U24.D7(A:VSSQ_D7) U24.E3(A:VSS_E3) U24.J1(A:VSS_J1) ; also sheet 1,2,3,4,5,6,7,9,10,11,12
RAM_A0: U24.H7(B:A0) ; also sheet 6
RAM_A1: U24.H8(B:A1) ; also sheet 6
RAM_A2: U24.J8(B:A2) ; also sheet 6
RAM_A3: U24.J7(B:A3) ; also sheet 6
RAM_A4: U24.J3(B:A4) ; also sheet 6
RAM_A5: U24.J2(B:A5) ; also sheet 6
RAM_A6: U24.H3(B:A6) ; also sheet 6
RAM_A7: U24.H2(B:A7) ; also sheet 6
RAM_A8: U24.H1(B:A8) ; also sheet 6
RAM_A9: U24.G3(B:A9) ; also sheet 6
RAM_A10: U24.H9(B:A10) ; also sheet 6
RAM_A11: U24.G2(B:A11) ; also sheet 6
RAM_BA0: U24.G7(B:BA0) ; also sheet 6
RAM_BA1: U24.G8(B:BA1) ; also sheet 6
RAM_CAS_: U24.F7(B:!CAS!) ; also sheet 6
RAM_CKE: U24.F3(B:CKE) ; also sheet 6
RAM_CLK: U24.F2(B:CLK) ; also sheet 6
RAM_CS_: U24.G9(B:!CS!) ; also sheet 6
RAM_DQ0: U24.A8(B:DQ0) ; also sheet 6
RAM_DQ1: U24.B9(B:DQ1) ; also sheet 6
RAM_DQ2: U24.B8(B:DQ2) ; also sheet 6
RAM_DQ3: U24.C9(B:DQ3) ; also sheet 6
RAM_DQ4: U24.C8(B:DQ4) ; also sheet 6
RAM_DQ5: U24.D9(B:DQ5) ; also sheet 6
RAM_DQ6: U24.D8(B:DQ6) ; also sheet 6
RAM_DQ7: U24.E9(B:DQ7) ; also sheet 6
RAM_DQ8: U24.E1(B:DQ8) ; also sheet 6
RAM_DQ9: U24.D2(B:DQ9) ; also sheet 6
RAM_DQ10: U24.D1(B:DQ10) ; also sheet 6
RAM_DQ11: U24.C2(B:DQ11) ; also sheet 6
RAM_DQ12: U24.C1(B:DQ12) ; also sheet 6
RAM_DQ13: U24.B2(B:DQ13) ; also sheet 6
RAM_DQ14: U24.B1(B:DQ14) ; also sheet 6
RAM_DQ15: U24.A2(B:DQ15) ; also sheet 6
RAM_DQM0: U24.E8(B:LDQM) ; also sheet 6
RAM_DQM1: U24.F1(B:UDQM) ; also sheet 6
RAM_RAS_: U24.F8(B:!RAS!) ; also sheet 6
RAM_WE_: U24.F9(B:!WE!) ; also sheet 6
VDD_B_1V8: C58.1 C59.1 C60.1 C61.1 U24.A7(A:VDDQ_A7) U24.A9(A:VDD_A9) U24.B3(A:VDDQ_B3) U24.C7(A:VDDQ_C7) U24.D3(A:VDDQ_D3) U24.E7(A:VDD_E7) U24.J9(A:VDD_J9) ; also sheet 1,2,6

### Buses
RAM_A[0..12]
RAM_DQ[0..15]
RAM_BA[0..1]

## Sheet 9 of 12: SD
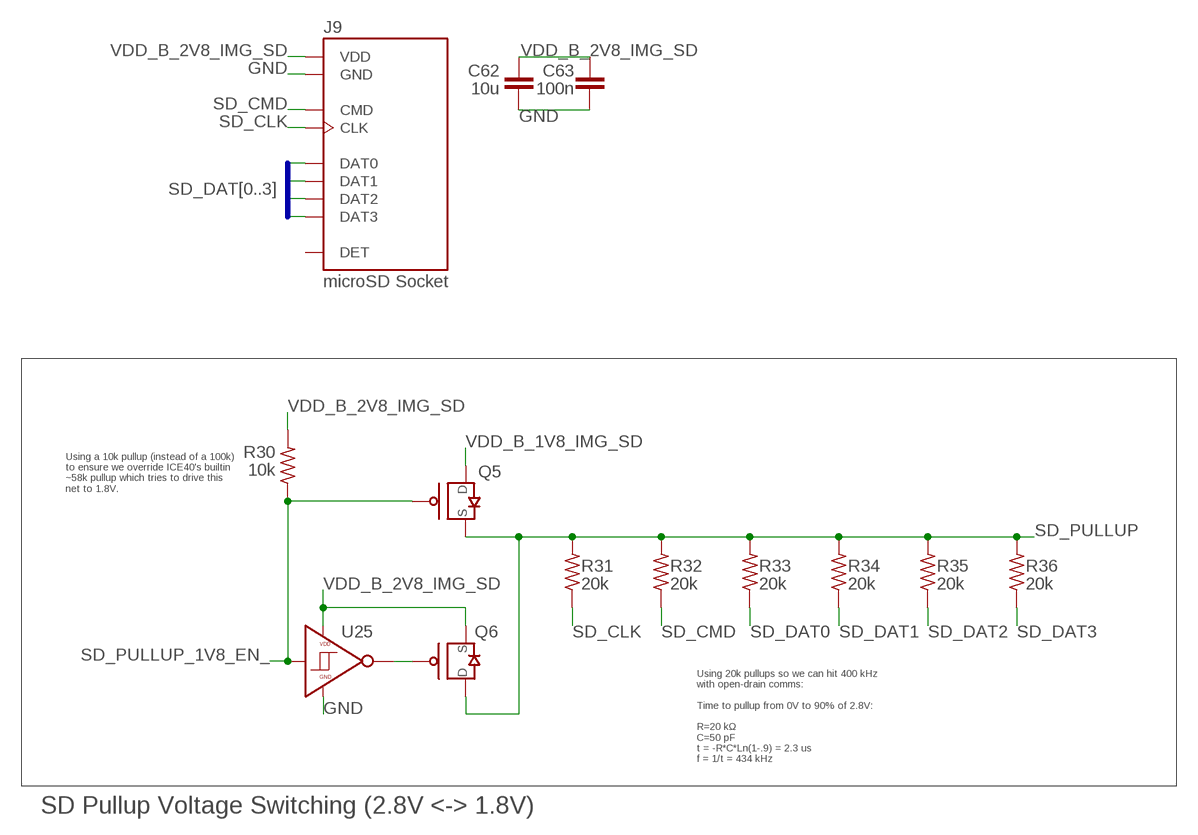
[diagram p8: schematic, sheet 9]

### Parts
C62  10u  CAPACITOR0805  [0805]
C63  100n  CAPACITOR0402  [0402]
J9  MICROSD-SOCKET  [MOLEX-1051620001]
Q5  DIODESINC-DMG2305UX  [DIODESINC-DMG2305UX]
Q6  DIODESINC-DMG2305UX  [DIODESINC-DMG2305UX]
R30  10k  RESISTOR0402  [0402]
R31  20k  RESISTOR0402  [0402]
R32  20k  RESISTOR0402  [0402]
R33  20k  RESISTOR0402  [0402]
R34  20k  RESISTOR0402  [0402]
R35  20k  RESISTOR0402  [0402]
R36  20k  RESISTOR0402  [0402]
U25  NEXPERIA-74LVC1G98-INVERTER  [NEXPERIA-SOT363]

### Nets
GND: C62.2 C63.2 J9.GND1(GND) J9.GND2(GND) J9.GND3(GND) J9.GND4(GND) J9.VSS(GND) U25.2(GND) U25.3(GND) U25.6(GND) ; also sheet 1,2,3,4,5,6,7,8,10,11,12
N$4: Q6.G U25.4(OUT)
SD_CLK: J9.CLK R31.1 ; also sheet 6
SD_CMD: J9.CMD R32.1 ; also sheet 6
SD_DAT0: J9.DAT0 R33.1 ; also sheet 6
SD_DAT1: J9.DAT1 R34.1 ; also sheet 6
SD_DAT2: J9.DAT2 R35.1 ; also sheet 6
SD_DAT3: J9.DAT3 R36.1 ; also sheet 6
SD_PULLUP: Q5.S Q6.D R31.2 R32.2 R33.2 R34.2 R35.2 R36.2
SD_PULLUP_1V8_EN_: Q5.G R30.1 U25.1(IN) ; also sheet 6
VDD_B_1V8_IMG_SD: Q5.D ; also sheet 1,7
VDD_B_2V8_IMG_SD: C62.1 C63.1 J9.VDD Q6.S R30.2 U25.5(VDD) ; also sheet 1,7
Unconnected: J9.DET

### Buses
SD_DAT[0..3]

### Notes on the sheet
- Using a 10k pullup (instead of a 100k)
  to ensure we override ICE40's builtin
  ~58k pullup which tries to drive this
  net to 1.8V.
- Using 20k pullups so we can hit 400 kHz
  with open-drain comms:
  
  Time to pullup from 0V to 90% of 2.8V:
  
  R=20 kΩ
  C=50 pF
  t = -R*C*Ln(1-.9) = 2.3 us
  f = 1/t = 434 kHz
- SD Pullup Voltage Switching (2.8V <-> 1.8V)

## Sheet 10 of 12: STM
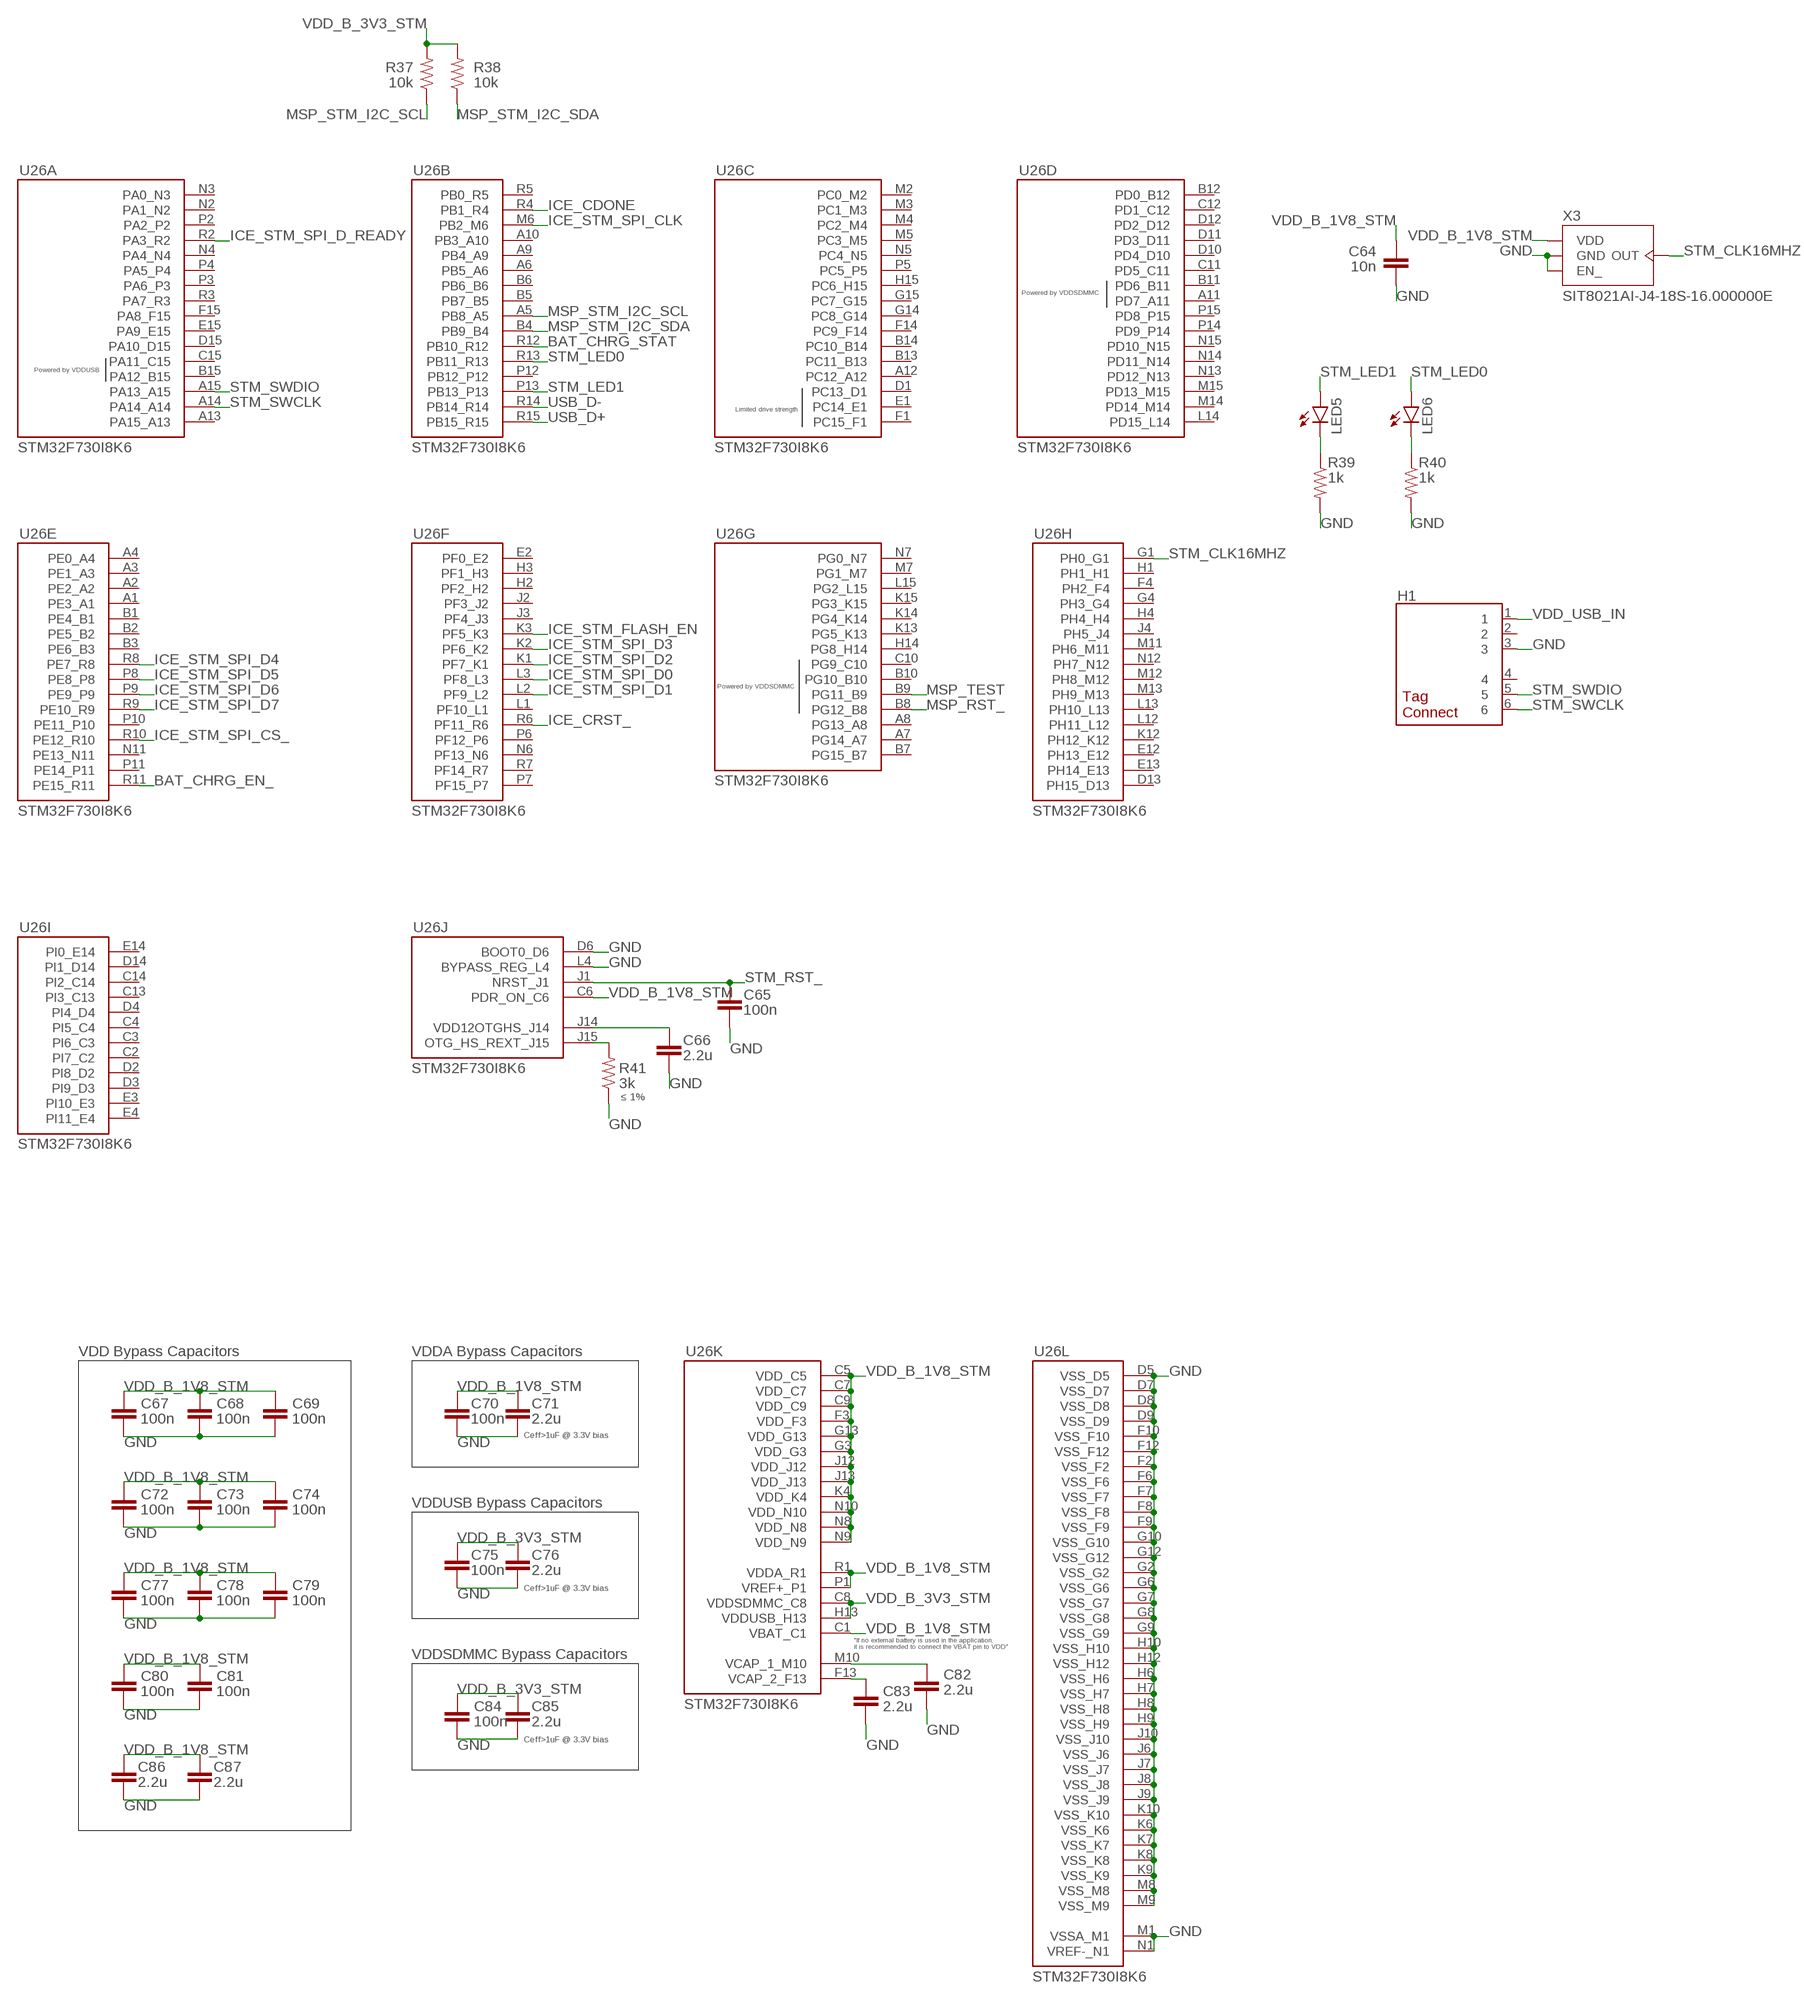
[diagram p9: schematic, sheet 10]

### Parts
C64  10n  CAPACITOR0402  [0402]
C65  100n  CAPACITOR0402  [0402]
C66  2.2u  CAPACITOR0402  [0402]
C67  100n  CAPACITOR0402  [0402]
C68  100n  CAPACITOR0402  [0402]
C69  100n  CAPACITOR0402  [0402]
C70  100n  CAPACITOR0402  [0402]
C71  2.2u  CAPACITOR0402  [0402]
C72  100n  CAPACITOR0402  [0402]
C73  100n  CAPACITOR0402  [0402]
C74  100n  CAPACITOR0402  [0402]
C75  100n  CAPACITOR0402  [0402]
C76  2.2u  CAPACITOR0402  [0402]
C77  100n  CAPACITOR0402  [0402]
C78  100n  CAPACITOR0402  [0402]
C79  100n  CAPACITOR0402  [0402]
C80  100n  CAPACITOR0402  [0402]
C81  100n  CAPACITOR0402  [0402]
C82  2.2u  CAPACITOR0402  [0402]
C83  2.2u  CAPACITOR0402  [0402]
C84  100n  CAPACITOR0402  [0402]
C85  2.2u  CAPACITOR0402  [0402]
C86  2.2u  CAPACITOR0402  [0402]
C87  2.2u  CAPACITOR0402  [0402]
H1  TAGCONNECT-TC2030-NL  [TAGCONNECT-TC2030-NL]
LED5  LEDLED-0603  [LED-0603]
LED6  LEDLED-0603  [LED-0603]
R37  10k  RESISTOR0402  [0402]
R38  10k  RESISTOR0402  [0402]
R39  1k  RESISTOR0402  [0402]
R40  1k  RESISTOR0402  [0402]
R41  3k  RESISTOR0402  [0402]
U26  STM-STM32F730  [STM-STM32F730I8]
X3  SITIME-SIT8021  [SITIME-SIT8021]

### Nets
BAT_CHRG_EN_: U26.R11(E:PE15_R11) ; also sheet 1
BAT_CHRG_STAT: U26.R12(B:PB10_R12) ; also sheet 1
GND: C64.2 C65.2 C66.2 C67.2 C68.2 C69.2 C70.2 C71.2 C72.2 C73.2 C74.2 C75.2 C76.2 C77.2 C78.2 C79.2 C80.2 C81.2 C82.2 C83.2 C84.2 C85.2 C86.2 C87.2 H1.3 R39.2 R40.2 R41.1 U26.D5(L:VSS_D5) U26.D6(J:BOOT0_D6) U26.D7(L:VSS_D7) U26.D8(L:VSS_D8) U26.D9(L:VSS_D9) U26.F2(L:VSS_F2) U26.F6(L:VSS_F6) U26.F7(L:VSS_F7) U26.F8(L:VSS_F8) U26.F9(L:VSS_F9) U26.F10(L:VSS_F10) U26.F12(L:VSS_F12) U26.G2(L:VSS_G2) U26.G6(L:VSS_G6) U26.G7(L:VSS_G7) U26.G8(L:VSS_G8) U26.G9(L:VSS_G9) U26.G10(L:VSS_G10) U26.G12(L:VSS_G12) U26.H6(L:VSS_H6) U26.H7(L:VSS_H7) U26.H8(L:VSS_H8) U26.H9(L:VSS_H9) U26.H10(L:VSS_H10) U26.H12(L:VSS_H12) U26.J6(L:VSS_J6) U26.J7(L:VSS_J7) U26.J8(L:VSS_J8) U26.J9(L:VSS_J9) U26.J10(L:VSS_J10) U26.K6(L:VSS_K6) U26.K7(L:VSS_K7) U26.K8(L:VSS_K8) U26.K9(L:VSS_K9) U26.K10(L:VSS_K10) U26.L4(J:BYPASS_REG_L4) U26.M1(L:VSSA_M1) U26.M8(L:VSS_M8) U26.M9(L:VSS_M9) U26.N1(L:VREF-_N1) X3.1(EN_) X3.4(GND) ; also sheet 1,2,3,4,5,6,7,8,9,11,12
ICE_CDONE: U26.R4(B:PB1_R4) ; also sheet 6
ICE_CRST_: U26.R6(F:PF11_R6) ; also sheet 6
ICE_STM_FLASH_EN: U26.K3(F:PF5_K3) ; also sheet 6
ICE_STM_SPI_CLK: U26.M6(B:PB2_M6) ; also sheet 6
ICE_STM_SPI_CS_: U26.R10(E:PE12_R10) ; also sheet 6
ICE_STM_SPI_D0: U26.L3(F:PF8_L3) ; also sheet 6
ICE_STM_SPI_D1: U26.L2(F:PF9_L2) ; also sheet 6
ICE_STM_SPI_D2: U26.K1(F:PF7_K1) ; also sheet 6
ICE_STM_SPI_D3: U26.K2(F:PF6_K2) ; also sheet 6
ICE_STM_SPI_D4: U26.R8(E:PE7_R8) ; also sheet 6
ICE_STM_SPI_D5: U26.P8(E:PE8_P8) ; also sheet 6
ICE_STM_SPI_D6: U26.P9(E:PE9_P9) ; also sheet 6
ICE_STM_SPI_D7: U26.R9(E:PE10_R9) ; also sheet 6
ICE_STM_SPI_D_READY: U26.R2(A:PA3_R2) ; also sheet 6
MSP_RST_: U26.B8(G:PG12_B8) ; also sheet 2
MSP_STM_I2C_SCL: R37.1 U26.A5(B:PB8_A5) ; also sheet 2
MSP_STM_I2C_SDA: R38.1 U26.B4(B:PB9_B4) ; also sheet 2
MSP_TEST: U26.B9(G:PG11_B9) ; also sheet 2
N$2: C82.1 U26.M10(K:VCAP_1_M10)
N$7: C83.1 U26.F13(K:VCAP_2_F13)
N$10: R41.2 U26.J15(J:OTG_HS_REXT_J15)
N$25: C66.1 U26.J14(J:VDD12OTGHS_J14)
N$30: LED6.C R40.1
N$31: LED5.C R39.1
STM_CLK16MHZ: U26.G1(H:PH0_G1) X3.2(OUT)
STM_LED0: LED6.A U26.R13(B:PB11_R13)
STM_LED1: LED5.A U26.P13(B:PB13_P13)
STM_RST_: C65.1 U26.J1(J:NRST_J1)
STM_SWCLK: H1.6 U26.A14(A:PA14_A14)
STM_SWDIO: H1.5 U26.A15(A:PA13_A15)
USB_D+: U26.R15(B:PB15_R15) ; also sheet 11
USB_D-: U26.R14(B:PB14_R14) ; also sheet 11
VDD_B_1V8_STM: C64.1 C67.1 C68.1 C69.1 C70.1 C71.1 C72.1 C73.1 C74.1 C77.1 C78.1 C79.1 C80.1 C81.1 C86.1 C87.1 U26.C1(K:VBAT_C1) U26.C5(K:VDD_C5) U26.C6(J:PDR_ON_C6) U26.C7(K:VDD_C7) U26.C9(K:VDD_C9) U26.F3(K:VDD_F3) U26.G3(K:VDD_G3) U26.G13(K:VDD_G13) U26.J12(K:VDD_J12) U26.J13(K:VDD_J13) U26.K4(K:VDD_K4) U26.N8(K:VDD_N8) U26.N9(K:VDD_N9) U26.N10(K:VDD_N10) U26.P1(K:VREF+_P1) U26.R1(K:VDDA_R1) X3.3(VDD) ; also sheet 1
VDD_B_3V3_STM: C75.1 C76.1 C84.1 C85.1 R37.2 R38.2 U26.C8(K:VDDSDMMC_C8) U26.H13(K:VDDUSB_H13) ; also sheet 1,2
VDD_USB_IN: H1.1 ; also sheet 1,11
Unconnected: H1.2 H1.4 U26.A1(E:PE3_A1) U26.A2(E:PE2_A2) U26.A3(E:PE1_A3) U26.A4(E:PE0_A4) U26.A6(B:PB5_A6) U26.A7(G:PG14_A7) U26.A8(G:PG13_A8) U26.A9(B:PB4_A9) U26.A10(B:PB3_A10) U26.A11(D:PD7_A11) U26.A12(C:PC12_A12) U26.A13(A:PA15_A13) U26.B1(E:PE4_B1) U26.B2(E:PE5_B2) U26.B3(E:PE6_B3) U26.B5(B:PB7_B5) U26.B6(B:PB6_B6) U26.B7(G:PG15_B7) U26.B10(G:PG10_B10) U26.B11(D:PD6_B11) U26.B12(D:PD0_B12) U26.B13(C:PC11_B13) U26.B14(C:PC10_B14) U26.B15(A:PA12_B15) U26.C2(I:PI7_C2) U26.C3(I:PI6_C3) U26.C4(I:PI5_C4) U26.C10(G:PG9_C10) U26.C11(D:PD5_C11) U26.C12(D:PD1_C12) U26.C13(I:PI3_C13) U26.C14(I:PI2_C14) U26.C15(A:PA11_C15) U26.D1(C:PC13_D1) U26.D2(I:PI8_D2) U26.D3(I:PI9_D3) U26.D4(I:PI4_D4) U26.D10(D:PD4_D10) U26.D11(D:PD3_D11) U26.D12(D:PD2_D12) U26.D13(H:PH15_D13) U26.D14(I:PI1_D14) U26.D15(A:PA10_D15) U26.E1(C:PC14_E1) U26.E2(F:PF0_E2) U26.E3(I:PI10_E3) U26.E4(I:PI11_E4) U26.E12(H:PH13_E12) U26.E13(H:PH14_E13) U26.E14(I:PI0_E14) U26.E15(A:PA9_E15) U26.F1(C:PC15_F1) U26.F4(H:PH2_F4) U26.F14(C:PC9_F14) U26.F15(A:PA8_F15) U26.G4(H:PH3_G4) U26.G14(C:PC8_G14) U26.G15(C:PC7_G15) U26.H1(H:PH1_H1) U26.H2(F:PF2_H2) U26.H3(F:PF1_H3) U26.H4(H:PH4_H4) U26.H14(G:PG8_H14) U26.H15(C:PC6_H15) U26.J2(F:PF3_J2) U26.J3(F:PF4_J3) U26.J4(H:PH5_J4) U26.K12(H:PH12_K12) U26.K13(G:PG5_K13) U26.K14(G:PG4_K14) U26.K15(G:PG3_K15) U26.L1(F:PF10_L1) U26.L12(H:PH11_L12) U26.L13(H:PH10_L13) U26.L14(D:PD15_L14) U26.L15(G:PG2_L15) U26.M2(C:PC0_M2) U26.M3(C:PC1_M3) U26.M4(C:PC2_M4) U26.M5(C:PC3_M5) U26.M7(G:PG1_M7) U26.M11(H:PH6_M11) U26.M12(H:PH8_M12) U26.M13(H:PH9_M13) U26.M14(D:PD14_M14) U26.M15(D:PD13_M15) U26.N2(A:PA1_N2) U26.N3(A:PA0_N3) U26.N4(A:PA4_N4) U26.N5(C:PC4_N5) U26.N6(F:PF13_N6) U26.N7(G:PG0_N7) U26.N11(E:PE13_N11) U26.N12(H:PH7_N12) U26.N13(D:PD12_N13) U26.N14(D:PD11_N14) U26.N15(D:PD10_N15) U26.P2(A:PA2_P2) U26.P3(A:PA6_P3) U26.P4(A:PA5_P4) U26.P5(C:PC5_P5) U26.P6(F:PF12_P6) U26.P7(F:PF15_P7) U26.P10(E:PE11_P10) U26.P11(E:PE14_P11) U26.P12(B:PB12_P12) U26.P14(D:PD9_P14) U26.P15(D:PD8_P15) U26.R3(A:PA7_R3) U26.R5(B:PB0_R5) U26.R7(F:PF14_R7)

### Notes on the sheet
- ≤ 1%
- VDD Bypass Capacitors | VDDA Bypass Capacitors
- Ceff>1uF @ 3.3V bias
- VDDUSB Bypass Capacitors
- Ceff>1uF @ 3.3V bias
- "If no external battery is used in the application,
  it is recommended to connect the VBAT pin to VDD"
- VDDSDMMC Bypass Capacitors
- Ceff>1uF @ 3.3V bias

## Sheet 11 of 12: USB
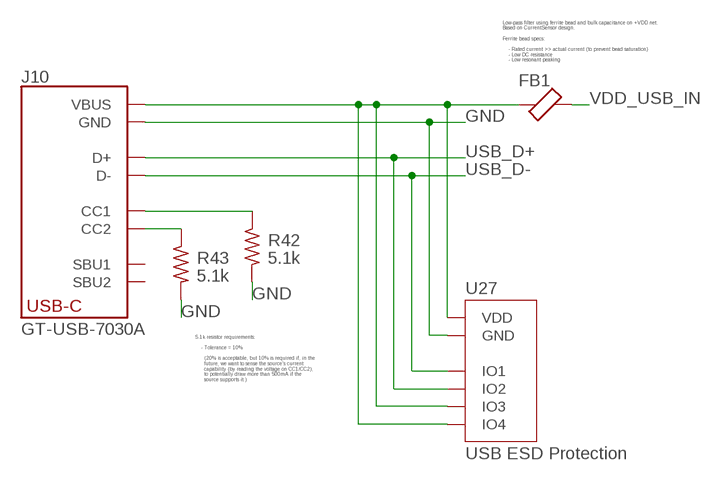
[diagram p10: schematic, sheet 11]

### Parts
FB1  FERRITE-BEAD0402  [0402]
J10  USB-C-RECEPTACLE-GSWITCH-7030A  [GSWITCH-GT-USB-7030A]
R42  5.1k  RESISTOR0402  [0402]
R43  5.1k  RESISTOR0402  [0402]
U27  DIODESINC-DT1446-04V-7  [DIODESINC-DT1446-04V-7]

### Nets
GND: J10.A12B1(GND) J10.B12A1(GND) J10.GND1(GND) J10.GND2(GND) J10.GND3(GND) J10.GND4(GND) R42.2 R43.2 U27.2(GND) ; also sheet 1,2,3,4,5,6,7,8,9,10,12
N$35: J10.A5(CC1) R42.1
N$36: J10.B5(CC2) R43.1
N$54: FB1.1 J10.A9B4(VBUS) J10.B9A4(VBUS) U27.4(IO3) U27.5(VDD) U27.6(IO4)
USB_D+: J10.A6(D+) J10.B6(D+) U27.3(IO2) ; also sheet 10
USB_D-: J10.A7(D-) J10.B7(D-) U27.1(IO1) ; also sheet 10
VDD_USB_IN: FB1.2 ; also sheet 1,10
Unconnected: J10.A8(SBU1) J10.B8(SBU2)

### Notes on the sheet
- Low-pass filter using ferrite bead and bulk capacitance on +VDD net.
  Based on CurrentSensor design.
  
  Ferrite bead specs:
  
      - Rated current >> actual current (to prevent bead saturation)
      - Low DC resistance
      - Low resonant peaking
- 5.1k resistor requirements:
  
      - Tolerance = 10%
  
        (20% is acceptable, but 10% is required if, in the
        future, we want to sense the source's current
        capability (by reading the voltage on CC1/CC2),
        to potentially draw more than 500mA if the
        source supports it.)

## Sheet 12 of 12: MOUNTS
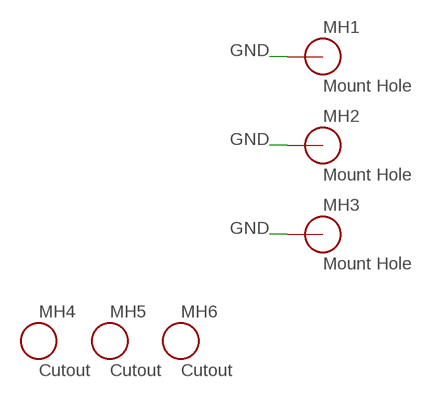
[diagram p11: schematic, sheet 12]

### Parts
MH1  MDC-MOUNT-HOLE  [MDC-MOUNT-HOLE]
MH2  MDC-MOUNT-HOLE  [MDC-MOUNT-HOLE]
MH3  MDC-MOUNT-HOLE  [MDC-MOUNT-HOLE]
MH4  MDC-CUTOUT-HALF  [MDC-CUTOUT-HALF]
MH5  MDC-CUTOUT-HALF  [MDC-CUTOUT-HALF]
MH6  MDC-CUTOUT-HALF  [MDC-CUTOUT-HALF]

### Nets
GND: MH1.1 MH2.1 MH3.1 ; also sheet 1,2,3,4,5,6,7,8,9,10,11

## Library data of the parts
C1 C5 C13-C16 C66 C71 C76 C82 C83 C85-C87 = EagleLibrary:CAPACITOR; AS-MOUNT: 1; AS-MOUNT-FAB: 1; AS-OUR-STOCK: 0; MFG: Taiyo Yuden; PN: TMK105CBJ225KV-F
C2 C6 C8 C10 C12 C20 C38 C41 C45 C47 C49 C53 C56 C60-C62 = EagleLibrary:CAPACITOR; AS-MOUNT: 1; AS-MOUNT-FAB: 1; AS-OUR-STOCK: 0; MFG: Samsung; PN: CL21A106KOQNNNE
C3 C4 C19 C22-C27 C29 C31 C34 C36 C39 C42-C44 C46 C48 C50-C52 C54 C55 C57-C59 C63 C65 C67-C70 C72-C75 C77-C81 C84 = EagleLibrary:CAPACITOR; AS-MOUNT: 1; AS-MOUNT-FAB: 1; AS-OUR-STOCK: 0; MFG: Murata; PN: GRM155R61H104KE19D
C7 C9 C11 = EagleLibrary:CAPACITOR; AS-MOUNT: 1; AS-MOUNT-FAB: 1; AS-OUR-STOCK: 0; MFG: Samsung; PN: CL21A226MQQNNNG
C17 C18 C21 = EagleLibrary:CAPACITOR; AS-MOUNT: 1; AS-MOUNT-FAB: 1; AS-OUR-STOCK: 0; MFG: Murata; PN: GRM1555C1H220JA01D
C28 C30 C32 C33 C35 C37 C40 C64 = EagleLibrary:CAPACITOR; AS-MOUNT: 1; AS-MOUNT-FAB: 1; AS-OUR-STOCK: 0; MFG: Samsung; PN: CL05B103KB5NNNC
D1 = EagleLibrary:ROHM-RB168MM-40; AS-MOUNT: 1; AS-MOUNT-FAB: 1; AS-OUR-STOCK: 1; MFG: ROHM; PN: RB168MM-40
FB1 = EagleLibrary:FERRITE-BEAD; AS-MOUNT: 1; AS-MOUNT-FAB: 1; AS-OUR-STOCK: 1; MFG: Taiyo Yuden; PN: BKP1005EM100-T
H1 = EagleLibrary:TAGCONNECT-TC2030-NL: TagConnect 6-pin Receptacle; AS-MOUNT: 0; AS-MOUNT-FAB: 0; AS-OUR-STOCK: 0
J1-J4 J6-J8 = EagleLibrary:JUMPER; AS-MOUNT: 0; AS-MOUNT-FAB: 0; AS-OUR-STOCK: 0
J5 = EagleLibrary:BATTERY-HEADER; AS-MOUNT: 1; AS-MOUNT-FAB: 1; AS-OUR-STOCK: 0; MFG: Molex; PN: 781710002
J9 = EagleLibrary:MICROSD-SOCKET: microSD Socket; AS-MOUNT: 1; AS-MOUNT-FAB: 1; AS-OUR-STOCK: 0; MFG: Molex; PN: 105162-0001
J10 = EagleLibrary:USB-C-RECEPTACLE; AS-MOUNT: 1; AS-MOUNT-FAB: 0; AS-OUR-STOCK: 0; MFG: G-Switch; PN: GT-USB-7030A
L1-L3 = EagleLibrary:INDUCTOR; AS-MOUNT: 1; AS-MOUNT-FAB: 1; AS-OUR-STOCK: 0; MFG: Samsung; PN: CIGT201610LH1R0MNE
LED1 = EagleLibrary:LED: LED; AS-MOUNT: 1; AS-MOUNT-FAB: 1; AS-OUR-STOCK: 0; MFG: OSRAM; PN: KT DELQS1.12-TIVH-36-S446-10-S
LED2 = EagleLibrary:LED: LED; AS-MOUNT: 1; AS-MOUNT-FAB: 1; AS-OUR-STOCK: 0; MFG: OSRAM; PN: KR DELPS1.22-UHVI-26-H3Q4
LED3-LED6 = EagleLibrary:LED: LED; AS-MOUNT: 1; AS-MOUNT-FAB: 1; AS-OUR-STOCK: 0; MFG: OSRAM; PN: KS DELLS1.22-JHKI-1
MH1-MH3 = EagleLibrary:MDC-MOUNT-HOLE; AS-MOUNT: 0; AS-MOUNT-FAB: 0; AS-OUR-STOCK: 0
MH4-MH6 = EagleLibrary:MDC-CUTOUT; AS-MOUNT: 0; AS-MOUNT-FAB: 0; AS-OUR-STOCK: 0
Q1-Q3 = EagleLibrary:PMOS: PMOS MOSFET transistor; AS-MOUNT: 1; AS-MOUNT-FAB: 1; AS-OUR-STOCK: 1; MFG: Nexperia; PN: PMPB10UPX; PN2: PMPB16EP
Q4-Q6 = EagleLibrary:DIODESINC-DMG2305UX; AS-MOUNT: 1; AS-MOUNT-FAB: 1; AS-OUR-STOCK: 1; MFG: Diodes Incorporated; PN: DMG2305UX
R1 R4 R5 R10-R13 R15 R17 = EagleLibrary:RESISTOR; AS-MOUNT: 1; AS-MOUNT-FAB: 1; AS-OUR-STOCK: 0; MFG: Yageo; PN: RC0402FR-07100KL
R2 = EagleLibrary:RESISTOR; AS-MOUNT: 1; AS-MOUNT-FAB: 1; AS-OUR-STOCK: 0; MFG: Walsin; PN: WR04X3003FTL
R3 R25-R30 R37 R38 = EagleLibrary:RESISTOR; AS-MOUNT: 1; AS-MOUNT-FAB: 1; AS-OUR-STOCK: 0; MFG: Yageo; PN: RC0402JR-0710KL
R6 R16 = EagleLibrary:RESISTOR; AS-MOUNT: 1; AS-MOUNT-FAB: 1; AS-OUR-STOCK: 0; MFG: Walsin; PN: WR04X3653FTL
R7 = EagleLibrary:RESISTOR; AS-MOUNT: 1; AS-MOUNT-FAB: 1; AS-OUR-STOCK: 0; MFG: Bourns; PN: CR0402-JW-272GLF
R8 R21 R22 R39 R40 = EagleLibrary:RESISTOR; AS-MOUNT: 1; AS-MOUNT-FAB: 1; AS-OUR-STOCK: 0; MFG: Kamaya; PN: RGC1/16SC1001DTH
R9 R41 = EagleLibrary:RESISTOR; AS-MOUNT: 1; AS-MOUNT-FAB: 1; AS-OUR-STOCK: 0; MFG: Susumu; PN: RR0510P-302-D
R14 = EagleLibrary:RESISTOR; AS-MOUNT: 1; AS-MOUNT-FAB: 1; AS-OUR-STOCK: 0; MFG: Yageo; PN: RC0402FR-13200KL
R18-R20 R23 R24 = EagleLibrary:RESISTOR; AS-MOUNT: 1; AS-MOUNT-FAB: 1; AS-OUR-STOCK: 0; MFG: Walsin; PN: WR04X1000FQL
R31-R36 = EagleLibrary:RESISTOR; AS-MOUNT: 1; AS-MOUNT-FAB: 1; AS-OUR-STOCK: 0; MFG: Walsin; PN: WR04X203 JTL
R42 R43 = EagleLibrary:RESISTOR; AS-MOUNT: 1; AS-MOUNT-FAB: 1; AS-OUR-STOCK: 0; MFG: Yageo; PN: AC0402FR-075K1L
SW1 = EagleLibrary:TACTILE-SWITCH; AS-MOUNT: 1; AS-MOUNT-FAB: 1; AS-OUR-STOCK: 1; MFG: SHOU HAN; PN: TS2306A 240gf MSM 9
TP1 = EagleLibrary:TEST-POINT: Bare copper test point; AS-MOUNT: 0; AS-MOUNT-FAB: 0; AS-OUR-STOCK: 0
U1 = EagleLibrary:TI-TPS2116; AS-MOUNT: 1; AS-MOUNT-FAB: 1; AS-OUR-STOCK: 1; MFG: Texas Instruments; PN: TPS2116DRLR
U2 = EagleLibrary:DIODESINC-AP7350; AS-MOUNT: 1; AS-MOUNT-FAB: 1; AS-OUR-STOCK: 1; MFG: Diodes Incorporated; PN: AP7350-33CF4-7
U3 = EagleLibrary:NEXPERIA-74LVC1G98-NOR; AS-MOUNT: 1; AS-MOUNT-FAB: 1; AS-OUR-STOCK: 1; MFG: Nexperia; PN: 74LVC1G98GW,125
U4 = EagleLibrary:MICROCHIP-MCP7383X; AS-MOUNT: 1; AS-MOUNT-FAB: 1; AS-OUR-STOCK: 1; MFG: Microchip; PN: MCP73831T-2ACI/OT
U5 U10-U13 = EagleLibrary:TI-TPS22919DCK; AS-MOUNT: 1; AS-MOUNT-FAB: 1; AS-OUR-STOCK: 1; MFG: Texas Instruments; PN: TPS22919DCK
U6 = EagleLibrary:EATON-STN101; AS-MOUNT: 1; AS-MOUNT-FAB: 1; AS-OUR-STOCK: 1; MFG: Eaton; PN: STN101050B101
U7-U9 = EagleLibrary:TI-TPS62A01; AS-MOUNT: 1; AS-MOUNT-FAB: 1; AS-OUR-STOCK: 1; MFG: Texas Instruments; PN: TPS62A01DRLR
U14 = EagleLibrary:TI-MSP430FR2433IRGE; AS-MOUNT: 1; AS-MOUNT-FAB: 1; AS-OUR-STOCK: 1; MFG: Texas Instruments; PN: MSP430FR2433IRGE
U15 = EagleLibrary:NEXPERIA-NXB0102; AS-MOUNT: 1; AS-MOUNT-FAB: 1; AS-OUR-STOCK: 0; MFG: Nexperia; PN: NXB0102UNZ
U16 U17 = EagleLibrary:NEXPERIA-74LVC1G98-MUX-INV-OUTPUT; AS-MOUNT: 1; AS-MOUNT-FAB: 1; AS-OUR-STOCK: 1; MFG: Nexperia; PN: 74LVC1G98GW,125
U18 = EagleLibrary:PANASONIC-EKMB110711X: Motion sensor; AS-MOUNT: 1; AS-MOUNT-FAB: 0; AS-OUR-STOCK: 0; MFG: Panasonic; PN: EKMB1107112
U19 = EagleLibrary:LATTICE-ICE40HX4K-BG121: Lattice ICE40 FPGA; AS-MOUNT: 1; AS-MOUNT-FAB: 0; AS-OUR-STOCK: 0; MFG: Lattice; PN: ICE40HX4K-BG121
U20 = EagleLibrary:WINBOND-W25Q40EW; AS-MOUNT: 1; AS-MOUNT-FAB: 1; AS-OUR-STOCK: 1; MFG: Winbond; PN: W25Q40EWUXIE
U21 = EagleLibrary:NEXPERIA-74LVC1G98-OR-INV-INPUT; AS-MOUNT: 1; AS-MOUNT-FAB: 1; AS-OUR-STOCK: 1; MFG: Nexperia; PN: 74LVC1G98GW,125
U22 = EagleLibrary:NEXPERIA-74LVC1G98-BUFFER; AS-MOUNT: 1; AS-MOUNT-FAB: 1; AS-OUR-STOCK: 1; MFG: Nexperia; PN: 74LVC1G98GW,125
U23 = EagleLibrary:ON-AR0330CS1C12SPKA0: 3.4 Megapixel CMOS Image Sensor; AS-MOUNT: 1; AS-MOUNT-FAB: 0; AS-OUR-STOCK: 0; MFG: ON Semiconductor; PN: AR0330CS1C12SPKA0-CR
U24 = EagleLibrary:ALLIANCE-AS4C8M16MSA-6BIN: 128M Low Power SDRAM; AS-MOUNT: 1; AS-MOUNT-FAB: 0; AS-OUR-STOCK: 0; MFG: Alliance Memory; PN: AS4C8M16MSA-6BIN
U25 = EagleLibrary:NEXPERIA-74LVC1G98-INVERTER; AS-MOUNT: 1; AS-MOUNT-FAB: 1; AS-OUR-STOCK: 1; MFG: Nexperia; PN: 74LVC1G98GW,125
U26 = EagleLibrary:STM-STM32F730; AS-MOUNT: 1; AS-MOUNT-FAB: 0; AS-OUR-STOCK: 0; MFG: STMicroelectronics; PN: STM32F730I8K6
U27 = EagleLibrary:DIODESINC-DT1446-04V-7; AS-MOUNT: 1; AS-MOUNT-FAB: 1; AS-OUR-STOCK: 1; MFG: Diodes Incorporated; PN: DT1446-04V-7
X1 = EagleLibrary:EPSON-FC-135; AS-MOUNT: 1; AS-MOUNT-FAB: 1; AS-OUR-STOCK: 1; MFG: Epson; PN: Q13FC13500005
X2 X3 = EagleLibrary:SITIME-SIT8021: MEMS Oscillator; AS-MOUNT: 1; AS-MOUNT-FAB: 1; AS-OUR-STOCK: 1; MFG: SiTime; PN: SIT8021AI-J4-18S-16.000000E